# EAGLE design VentilationsEvaluationDevBoard_v2.1.3_USB_C (EAGLE 9.6.2)
TEST: 1234

## Sheet 1 of 3
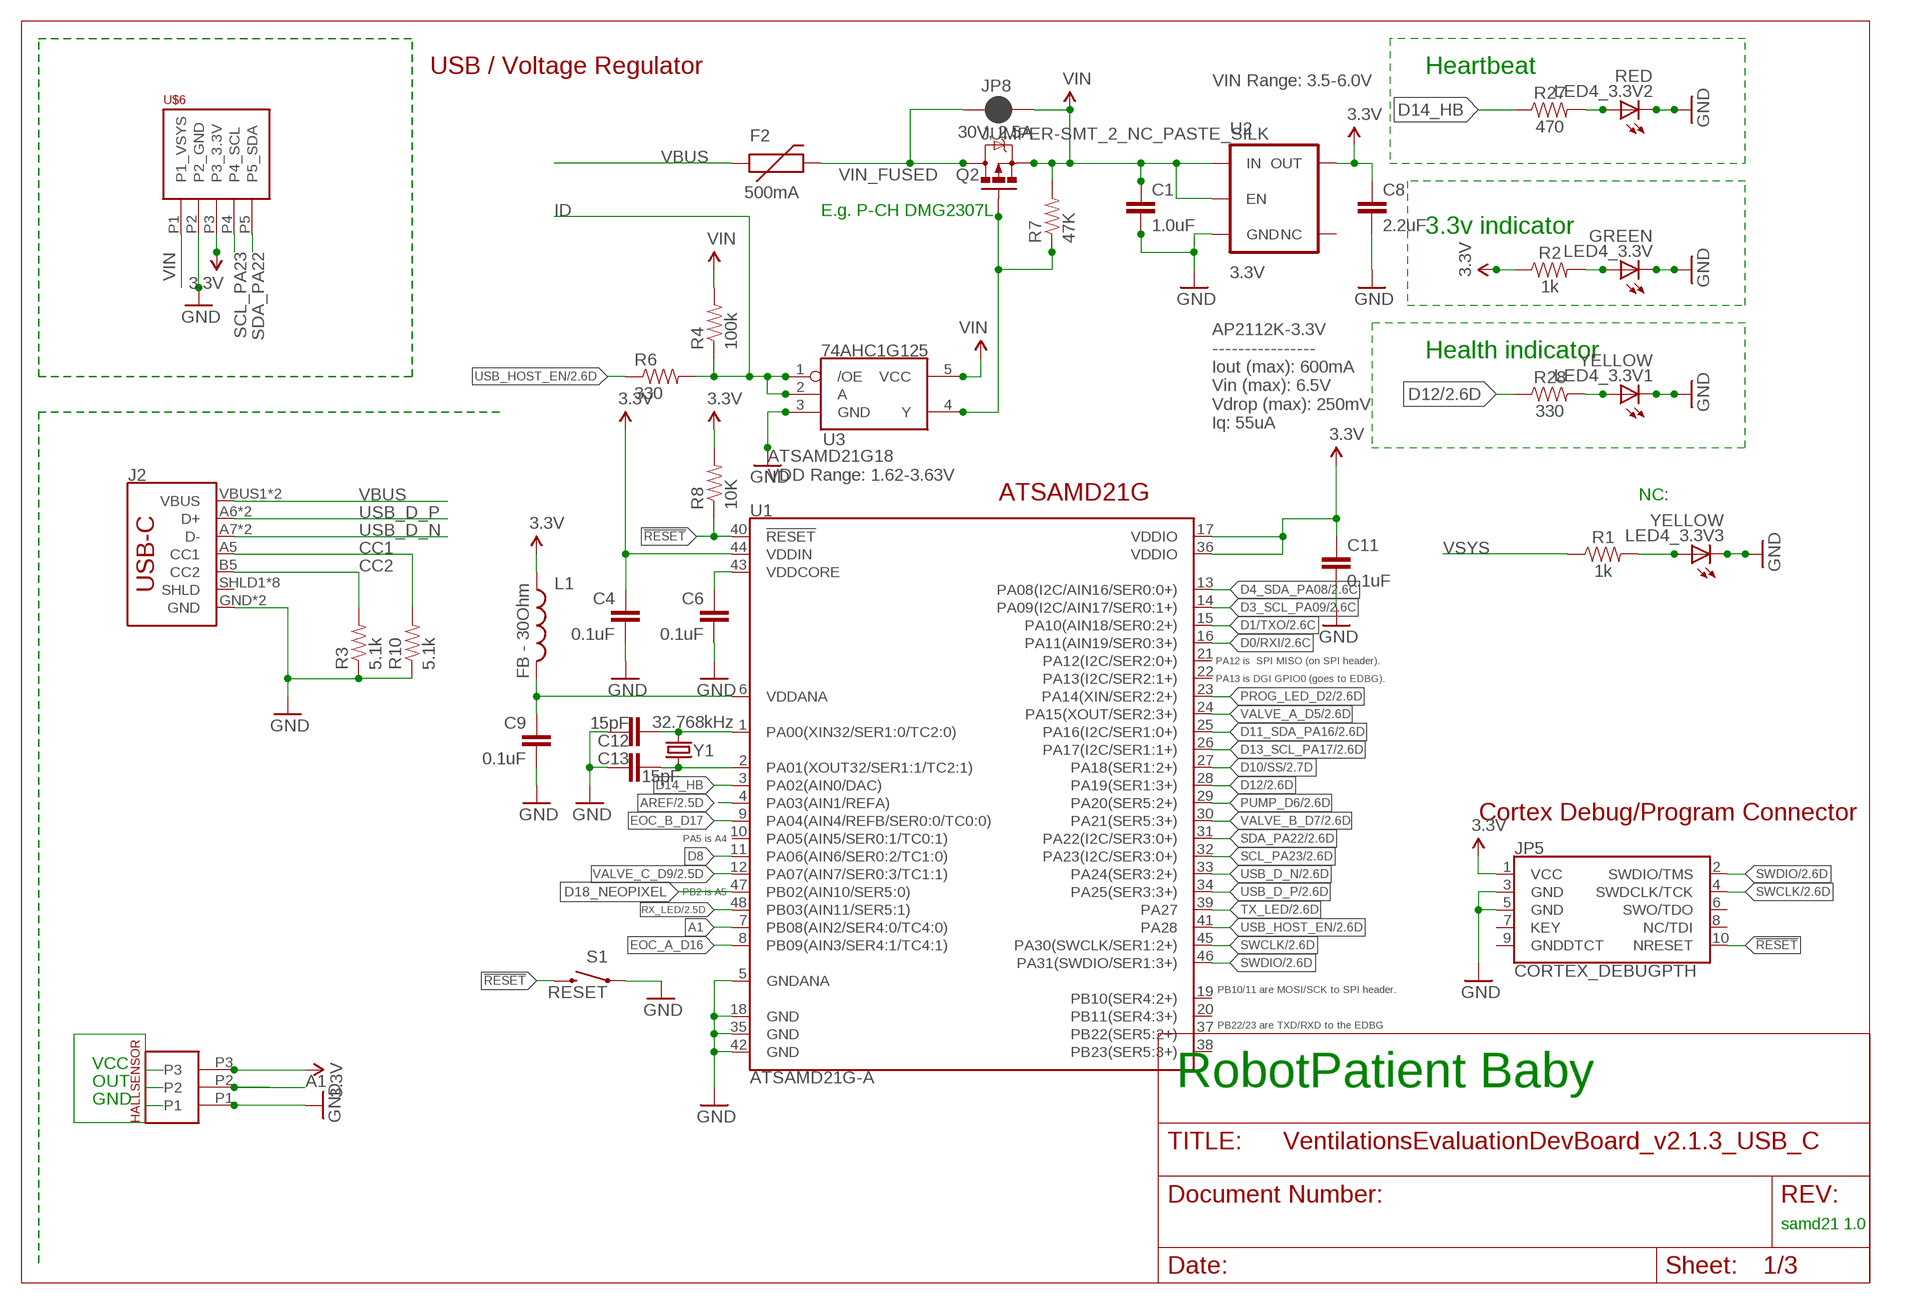
[diagram p0: schematic, sheet 1]

### Parts
C1  1.0uF  1.0UF-25V-+80/-20(0805)  [0805]
C4  0.1uF  0.1UF-16V(+-10%)(0402)  [0402-CAP]
C6  0.1uF  0.1UF-16V(+-10%)(0402)  [0402-CAP]
C8  2.2uF  2.2UF-10V-20%(0603)  [0603-CAP]
C9  0.1uF  0.1UF-16V(+-10%)(0402)  [0402-CAP]
C11  0.1uF  0.1UF-16V(+-10%)(0402)  [0402-CAP]
C12  15pF  15PF-50V(+-5%)(0402)  [0402-CAP]
C13  15pF  15PF-50V(+-5%)(0402)  [0402-CAP]
F2  500mA  PTCSMD  [PTC-1206]
HALLSENSOR  PHOENIX_PTSM_M3_TH_UP  [PTSM_M3_THR_UP]
J2  USB_C16PIN  [USB-C-16P]
JP5  CORTEX_DEBUGPTH  [2X5-PTH-1.27MM]
JP8  JUMPER-SMT_2_NC_PASTE_SILK  [SMT-JUMPER_2_NC_PASTE_SILK]
L1  FB - 30Ohm  INDUCTOR0603  [0603]
LED4_3.3V  GREEN  LED0603  [LED-0603]
LED4_3.3V1  YELLOW  LED0603  [LED-0603]
LED4_3.3V2  RED  LED0603  [LED-0603]
LED4_3.3V3  YELLOW  LED0603  [LED-0603]
Q2  30V, 2.5A  MOSFET-PCHANNELDMG2307L  [SOT23-3]
R1  1k  1KOHM-0603-1/10W-1%  [0603]
R2  1k  1KOHM-0603-1/10W-1%  [0603]
R3  5.1k  10KOHM-1/10W-1%(0603)0603  [0603-RES]
R4  100k  100KOHM-1/10W-1%(0603)  [0603-RES]
R6  330  330OHM1/10W1%(0603)  [0603-RES]
R7  47K  47KOHM1/10W1%(0603)  [0603-RES]
R8  10K  10KOHM-1/10W-1%(0603)0603  [0603-RES]
R10  5.1k  10KOHM-1/10W-1%(0603)0603  [0603-RES]
R27  470  470OHM-0603-1/10W-1%  [0603]
R28  330  330OHM-0603-1/10W-1%  [0603]
S1  RESET  SWITCH-MOMENTARY-2SMD-4.6X2.8MM  [TACTILE_SWITCH_SMD_4.6X2.8MM]
U1  ATSAMD21G-A  [TQFP-48]
U2  3.3V  V_REG_AP2112K-3.3V  [SOT23-5]
U3  74AHC1G125  [SOT23-5]
U$6  PHOENIX_PTSM_M5_TH_UP  [PTSM_M5_THR_UP]
Y1  32.768kHz  CRYSTAL3.2X1.5MM  [CRYSTAL-SMD-3.2X1.5MM]

### Nets
3.3V [power]: C4.1 C8.1 C11.1 HALLSENSOR.P3 JP5.1(VCC) L1.1 R2.1 R8.2 U1.17(VDDIO) U1.36(VDDIO) U1.44(VDDIN) U2.5(OUT) U$6.P3(P3_3.3V) ; also sheet 2,3
!RESET: JP5.10(NRESET) R8.1 S1.3 S1.4 U1.40(!RESET!)
A1: HALLSENSOR.P2 U1.7(PB08(AIN2/SER4:0/TC4:0))
AREF: U1.4(PA03(AIN1/REFA)) ; also sheet 2
CC1: J2.A5(CC1) R10.2
CC2: J2.B5(CC2) R3.2
D0/RXI: U1.16(PA11(AIN19/SER0:3+)) ; also sheet 2
D1/TXO: U1.15(PA10(AIN18/SER0:2+)) ; also sheet 2
D3_SCL_PA09: U1.14(PA09(I2C/AIN17/SER0:1+)) ; also sheet 2,3
D4_SDA_PA08: U1.13(PA08(I2C/AIN16/SER0:0+)) ; also sheet 2,3
D8: U1.11(PA06(AIN6/SER0:2/TC1:0))
D10/SS: U1.27(PA18(SER1:2+)) ; also sheet 2
D11_SDA_PA16: U1.25(PA16(I2C/SER1:0+)) ; also sheet 2,3
D12: R28.1 U1.28(PA19(SER1:3+)) ; also sheet 2
D13_SCL_PA17: U1.26(PA17(I2C/SER1:1+)) ; also sheet 2,3
D14_HB: R27.1 U1.3(PA02(AIN0/DAC))
D18_NEOPIXEL: U1.47(PB02(AIN10/SER5:0)) ; also sheet 2
EOC_A_D16: U1.8(PB09(AIN3/SER4:1/TC4:1)) ; also sheet 3
EOC_B_D17: U1.9(PA04(AIN4/REFB/SER0:0/TC0:0)) ; also sheet 3
GND [ground]: C1.2 C4.2 C6.2 C8.2 C9.2 C11.2 C12.1 C13.2 HALLSENSOR.P1 J2.GND J2.GND2(GND) JP5.3(GND) JP5.5(GND) LED4_3.3V1.C LED4_3.3V2.C LED4_3.3V3.C LED4_3.3V.C R3.1 R10.1 S1.1 S1.2 U1.5(GNDANA) U1.18(GND) U1.35(GND) U1.42(GND) U2.2(GND) U3.3(GND) U$6.P2(P2_GND) ; also sheet 2,3
ID: R4.1 R6.2 U3.1(/OE) U3.2(A)
N$1: LED4_3.3V2.A R27.2
N$2: LED4_3.3V1.A R28.2
N$3: LED4_3.3V3.A R1.2
N$8: C12.2 U1.1(PA00(XIN32/SER1:0/TC2:0)) Y1.P$2
N$12: Q2.1(G) R7.1 U3.4(Y)
N$13: C13.1 U1.2(PA01(XOUT32/SER1:1/TC2:1)) Y1.P$1
N$33: LED4_3.3V.A R2.2
PROG_LED_D2: U1.23(PA14(XIN/SER2:2+)) ; also sheet 2
PUMP_D6: U1.29(PA20(SER5:2+)) ; also sheet 2,3
RX_LED: U1.48(PB03(AIN11/SER5:1)) ; also sheet 2
SCL_PA23: U1.32(PA23(I2C/SER3:0+)) U$6.P4(P4_SCL) ; also sheet 2
SDA_PA22: U1.31(PA22(I2C/SER3:0+)) U$6.P5(P5_SDA) ; also sheet 2
SWCLK: JP5.4(SWDCLK/TCK) U1.45(PA30(SWCLK/SER1:2+)) ; also sheet 2
SWDIO: JP5.2(SWDIO/TMS) U1.46(PA31(SWDIO/SER1:3+)) ; also sheet 2
TX_LED: U1.39(PA27) ; also sheet 2
USB_D_N [diff_pair]: J2.A7(D-) J2.B7(D-) U1.33(PA24(SER3:2+)) ; also sheet 2
USB_D_P [diff_pair]: J2.A6(D+) J2.B6(D+) U1.34(PA25(SER3:3+)) ; also sheet 2
USB_HOST_EN: R6.1 U1.41(PA28) ; also sheet 2
VALVE_A_D5: U1.24(PA15(XOUT/SER2:3+)) ; also sheet 2,3
VALVE_B_D7: U1.30(PA21(SER5:3+)) ; also sheet 2,3
VALVE_C_D9: U1.12(PA07(AIN7/SER0:3/TC1:1)) ; also sheet 2,3
VBUS [power]: F2.1 J2.VBUS1(VBUS) J2.VBUS2(VBUS)
VDDANA [power]: C9.1 L1.2 U1.6(VDDANA)
VDDCORE [power]: C6.1 U1.43(VDDCORE)
VIN [power]: C1.1 JP8.2 Q2.2(S) R4.2 R7.2 U2.1(IN) U2.3(EN) U3.5(VCC) U$6.P1(P1_VSYS) ; also sheet 2
VIN_FUSED [power]: F2.2 JP8.1 Q2.3(D) ; also sheet 2
VSYS [power]: R1.1 ; also sheet 2
Unconnected: J2.SHLD1(SHLD) J2.SHLD2(SHLD) J2.SHLD3(SHLD) J2.SHLD4(SHLD) J2.SHLD5(SHLD) J2.SHLD6(SHLD) J2.SHLD7(SHLD) J2.SHLD8(SHLD) JP5.6(SWO/TDO) JP5.7(KEY) JP5.8(NC/TDI) JP5.9(GNDDTCT) U1.10(PA05(AIN5/SER0:1/TC0:1)) U1.19(PB10(SER4:2+)) U1.20(PB11(SER4:3+)) U1.21(PA12(I2C/SER2:0+)) U1.22(PA13(I2C/SER2:1+)) U1.37(PB22(SER5:2+)) U1.38(PB23(SER5:3+)) U2.4(NC)

### Notes on the sheet
- USB / Voltage Regulator
- VIN Range: 3.5-6.0V | Heartbeat
- E.g. P-CH DMG2307L
- 3.3v indicator
- AP2112K-3.3V
  ----------------
  Iout (max): 600mA 
  Vin (max): 6.5V
  Vdrop (max): 250mV
  Iq: 55uA
- Health indicator
- ATSAMD21G18
  VDD Range: 1.62-3.63V
- ATSAMD21G
- NC:
- PA12 is  SPI MISO (on SPI header).
- PA13 is DGI GPIO0 (goes to EDBG).
- Cortex Debug/Program Connector
- PA5 is A4
- PB2 is A5
- PB10/11 are MOSI/SCK to SPI header.
- PB22/23 are TXD/RXD to the EDBG
- VCC
- OUT | RobotPatient Baby
- GND
- samd21 1.0

## Sheet 2 of 3
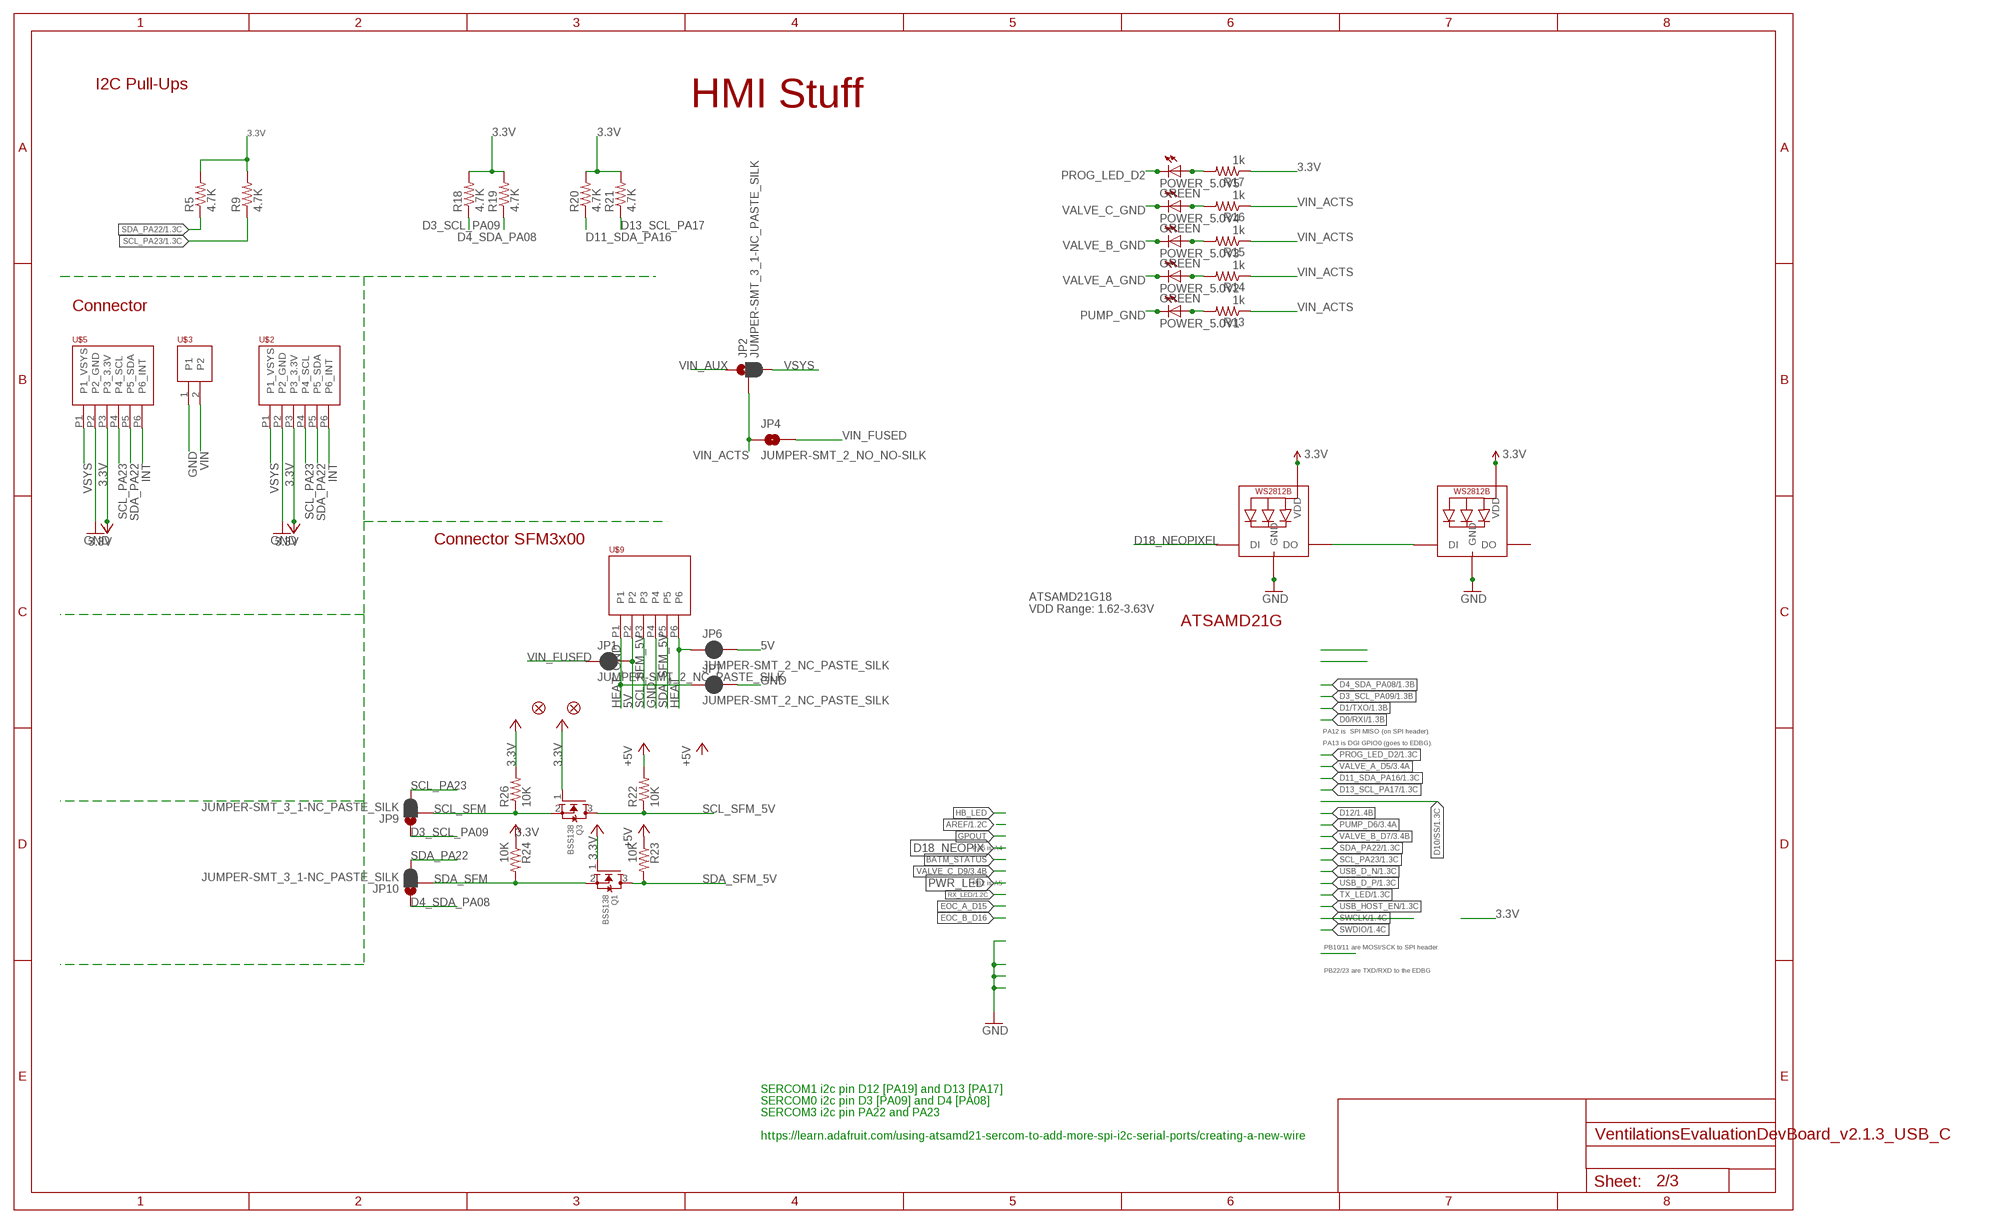
[diagram p1: schematic, sheet 2]

### Parts
FD1  FIDUCIAL1X2  [FIDUCIAL-1X2]
FD2  FIDUCIAL1X2  [FIDUCIAL-1X2]
JP1  JUMPER-SMT_2_NC_PASTE_SILK  [SMT-JUMPER_2_NC_PASTE_SILK]
JP2  JUMPER-SMT_3_1-NC_PASTE_SILK  [SMT-JUMPER_3_1-NC_PASTE_SILK]
JP4  JUMPER-SMT_2_NO_NO-SILK  [SMT-JUMPER_2_NO_NO-SILK]
JP6  JUMPER-SMT_2_NC_PASTE_SILK  [SMT-JUMPER_2_NC_PASTE_SILK]
JP7  JUMPER-SMT_2_NC_PASTE_SILK  [SMT-JUMPER_2_NC_PASTE_SILK]
JP9  JUMPER-SMT_3_1-NC_PASTE_SILK  [SMT-JUMPER_3_1-NC_PASTE_SILK]
JP10  JUMPER-SMT_3_1-NC_PASTE_SILK  [SMT-JUMPER_3_1-NC_PASTE_SILK]
LED1  WS2812B3535  [LED3535]
LED2  WS2812B3535  [LED3535]
POWER_5.0V1  GREEN  LED0603  [LED-0603]
POWER_5.0V2  GREEN  LED0603  [LED-0603]
POWER_5.0V3  GREEN  LED0603  [LED-0603]
POWER_5.0V4  GREEN  LED0603  [LED-0603]
POWER_5.0V5  GREEN  LED0603  [LED-0603]
Q1  BSS138  MOSFET-NREFLOW  [SOT23]
Q3  BSS138  MOSFET-NREFLOW  [SOT23]
R5  4.7K  4.7KOHM-1/10W-1%(0603)  [0603-RES@1]
R9  4.7K  4.7KOHM-1/10W-1%(0603)  [0603-RES@1]
R13  1k  10KOHM-1/10W-1%(0603)0603  [0603-RES]
R14  1k  10KOHM-1/10W-1%(0603)0603  [0603-RES]
R15  1k  10KOHM-1/10W-1%(0603)0603  [0603-RES]
R16  1k  10KOHM-1/10W-1%(0603)0603  [0603-RES]
R17  1k  10KOHM-1/10W-1%(0603)0603  [0603-RES]
R18  4.7K  4.7KOHM-1/10W-1%(0603)  [0603-RES@1]
R19  4.7K  4.7KOHM-1/10W-1%(0603)  [0603-RES@1]
R20  4.7K  4.7KOHM-1/10W-1%(0603)  [0603-RES@1]
R21  4.7K  4.7KOHM-1/10W-1%(0603)  [0603-RES@1]
R22  10K  R-US_R0805  [R0805]
R23  10K  R-US_R0805  [R0805]
R24  10K  R-US_R0805  [R0805]
R26  10K  R-US_R0805  [R0805]
U$2  PHOENIX_PTSM_M6_TH_I2CPPANGLE  [PTSM_M6_THRHOLE]
U$3  PHOENIX_PTSM_M2_TH  [PTSM_M2_THRHOLE]
U$5  PHOENIX_PTSM_M6_TH_I2CPPANGLE  [PTSM_M6_THRHOLE]
U$9  PHOENIX_PTSM_M6_TH_UP_NEUTRAL  [PTSM_M6_TH_UP_NEUTRAL]

### Nets
3.3V [power]: LED1.2(VDD) LED2.2(VDD) Q1.1(G) Q3.1(G) R5.2 R9.2 R17.1 R18.2 R19.2 R20.2 R21.2 R24.1 R26.2 U$2.P3(P3_3.3V) U$5.P3(P3_3.3V) ; supply symbol labelled +3V3 ; also sheet 1,3
5V [power]: JP1.2 JP6.2 R22.2 R23.1 U$9.P2 ; supply symbol labelled +5V
D3_SCL_PA09: JP9.1 R18.1 ; also sheet 1,3
D4_SDA_PA08: JP10.1 R19.1 ; also sheet 1,3
D11_SDA_PA16: R20.1 ; also sheet 1,3
D13_SCL_PA17: R21.1 ; also sheet 1,3
D18_NEOPIXEL: LED1.1(DI) ; also sheet 1
GND [ground]: JP7.2 LED1.4(GND) LED2.4(GND) U$2.P2(P2_GND) U$3.1 U$5.P2(P2_GND) U$9.P4 ; also sheet 1,3
HEAT [power]: JP6.1 U$9.P6
HEAT_GND [ground]: JP7.1 U$9.P1
INT: U$2.P6(P6_INT) U$5.P6(P6_INT)
N$24: POWER_5.0V1.A R13.2
N$25: POWER_5.0V2.A R14.2
N$27: POWER_5.0V3.A R15.2
N$28: POWER_5.0V4.A R16.2
N$29: POWER_5.0V5.A R17.2
NEOPIXEL_2: LED1.3(DO) LED2.1(DI)
PROG_LED_D2: POWER_5.0V5.C ; also sheet 1
PUMP_GND [ground]: POWER_5.0V1.C ; also sheet 3
SCL_PA23: JP9.3 R9.1 U$2.P4(P4_SCL) U$5.P4(P4_SCL) ; also sheet 1
SCL_SFM: JP9.2 Q3.2(S) R26.1
SCL_SFM_5V: Q3.3(D) R22.1 U$9.P3
SDA_PA22: JP10.3 R5.1 U$2.P5(P5_SDA) U$5.P5(P5_SDA) ; also sheet 1
SDA_SFM: JP10.2 Q1.2(S) R24.2
SDA_SFM_5V: Q1.3(D) R23.2 U$9.P5
VALVE_A_GND [ground]: POWER_5.0V2.C ; also sheet 3
VALVE_B_GND [ground]: POWER_5.0V3.C ; also sheet 3
VALVE_C_GND [ground]: POWER_5.0V4.C ; also sheet 3
VIN [power]: U$3.2 ; also sheet 1
VIN_ACTS [power]: JP2.2 JP4.1 R13.1 R14.1 R15.1 R16.1 ; also sheet 3
VIN_AUX: JP2.1
VIN_FUSED [power]: JP1.1 JP4.2 ; also sheet 1
VSYS [power]: JP2.3 U$2.P1(P1_VSYS) U$5.P1(P1_VSYS) ; also sheet 1
Unconnected: LED2.3(DO)

### Notes on the sheet
- I2C Pull-Ups | HMI Stuff
- Connector
- Connector SFM3x00
- ATSAMD21G18
  VDD Range: 1.62-3.63V
- ATSAMD21G
- PA12 is  SPI MISO (on SPI header).
- PA13 is DGI GPIO0 (goes to EDBG).
- PA5 is A4
- PB2 is A5
- PB10/11 are MOSI/SCK to SPI header.
- PB22/23 are TXD/RXD to the EDBG
- SERCOM1 i2c pin D12 [PA19] and D13 [PA17]
- SERCOM0 i2c pin D3 [PA09] and D4 [PA08]
- SERCOM3 i2c pin PA22 and PA23
- https://learn.adafruit.com/using-atsamd21-sercom-to-add-more-spi-i2c-serial-ports/creating-a-new-wire

## Sheet 3 of 3
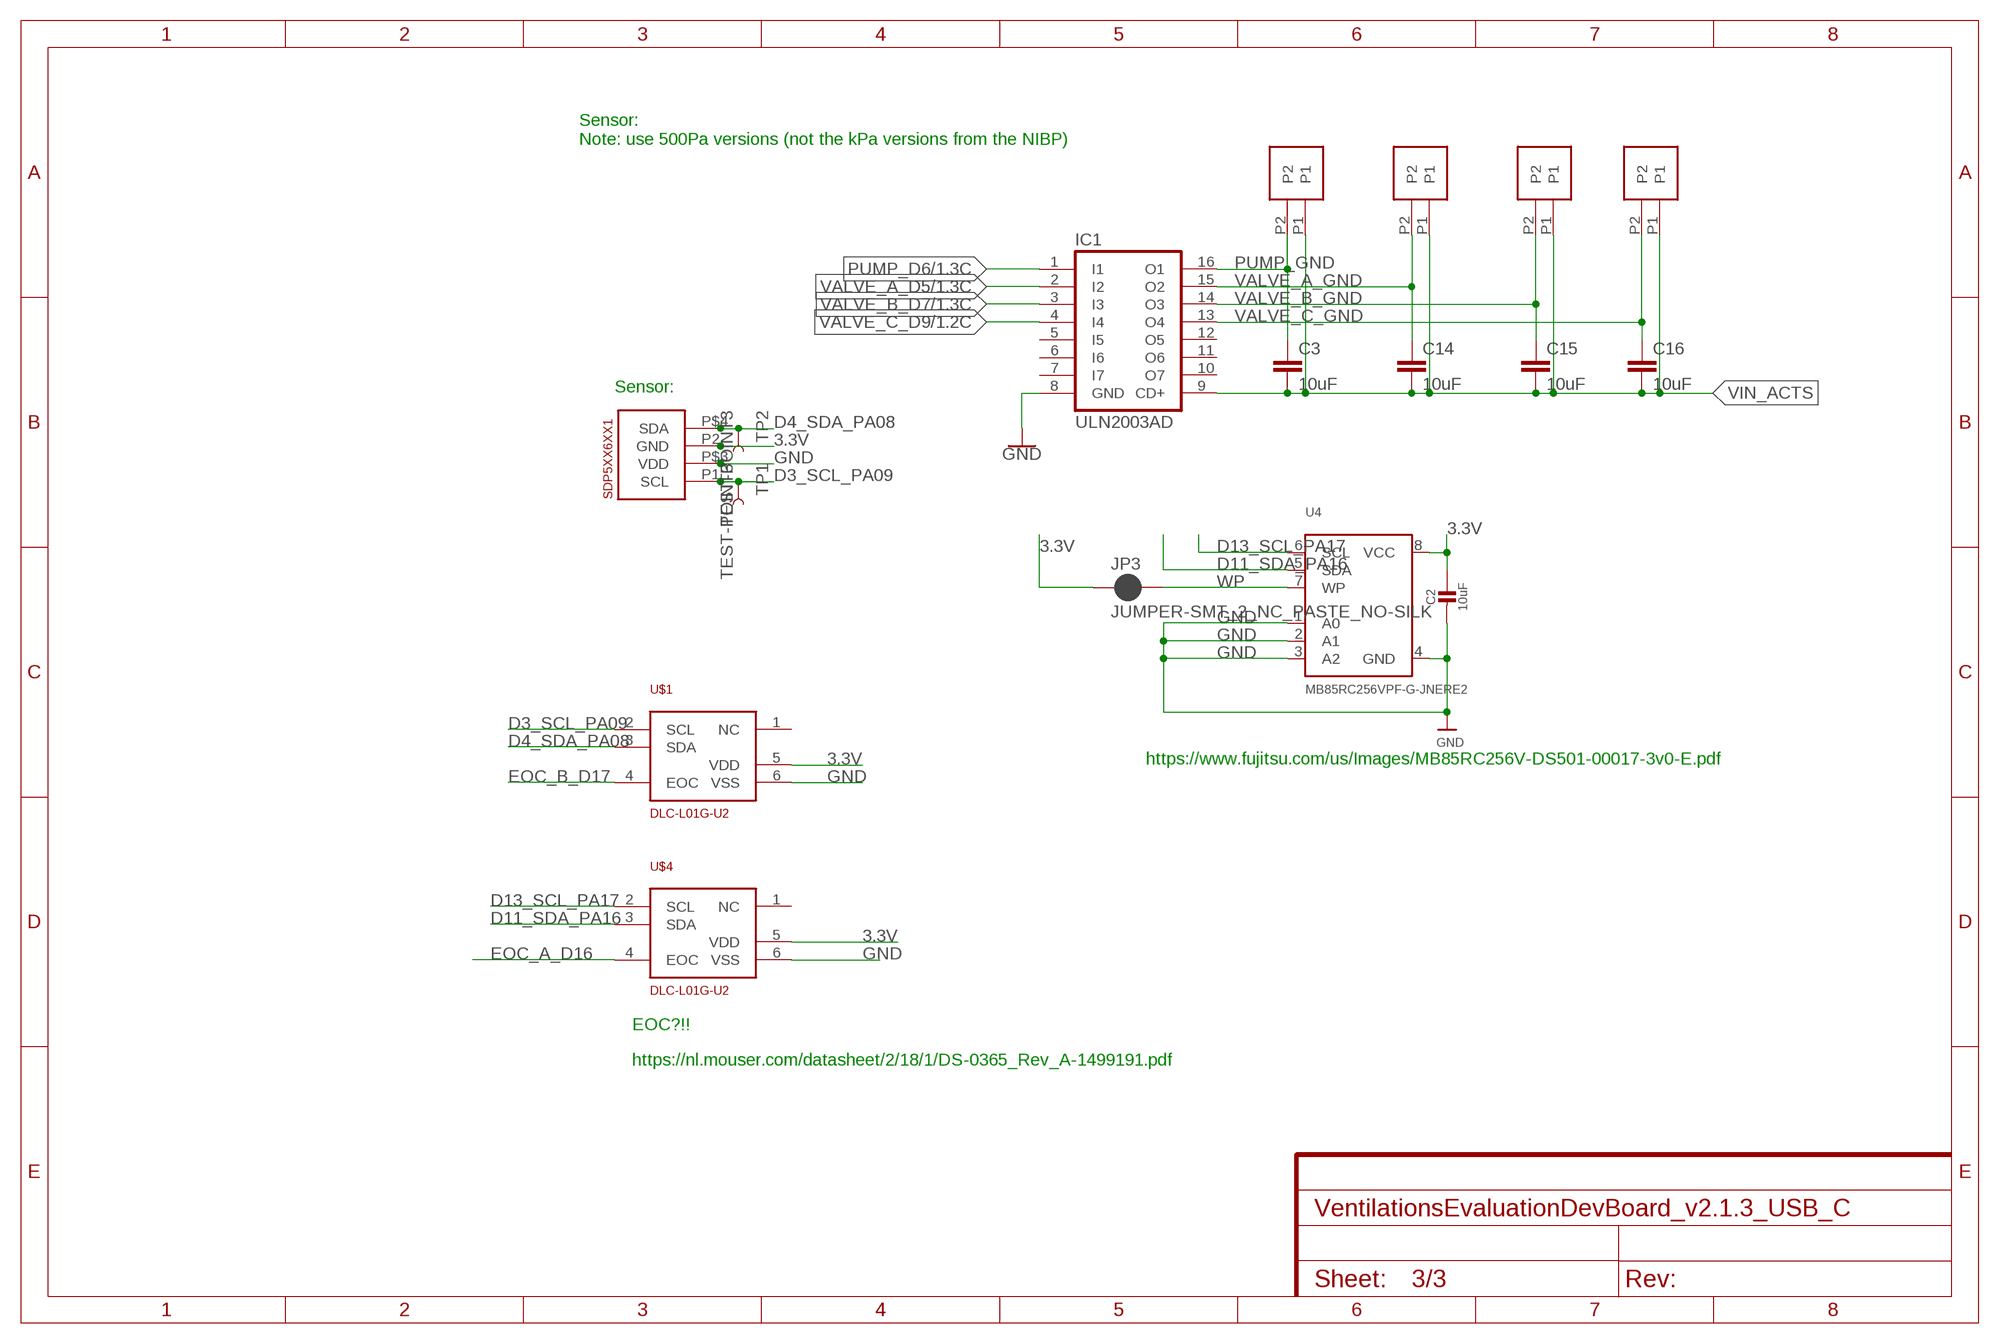
[diagram p2: schematic, sheet 3]

### Parts
C2  10uF  CAP_CERAMIC_0805MP  [_0805MP]
C3  10uF  10UF-0805-10V-10%  [0805]
C14  10uF  10UF-0805-10V-10%  [0805]
C15  10uF  10UF-0805-10V-10%  [0805]
C16  10uF  10UF-0805-10V-10%  [0805]
IC1  ULN2003AD  [SO16]
JP3  JUMPER-SMT_2_NC_PASTE_NO-SILK  [SMT-JUMPER_2_NC_PASTE_NO-SILK]
PUMP  PHOENIX_PTSM_M2_SMD  [PTSM_M2_SMD]
SDP5XX6XX1  SDP5XX_6XX  [SDP5XX_6XX]
TP1  TEST-POINT3  [PAD.03X.03]
TP2  TEST-POINT3  [PAD.03X.03]
U4  MB85RC256VPF-G-JNERE2  FRAM_SOIC8_I2C  [SOIC8_208MIL]
U$1  DLC-L01G-U2  [DLC-L01G-U2]
U$4  DLC-L01G-U2  [DLC-L01G-U2]
VALVE_A  PHOENIX_PTSM_M2_SMD  [PTSM_M2_SMD]
VALVE_B  PHOENIX_PTSM_M2_SMD  [PTSM_M2_SMD]
VALVE_C  PHOENIX_PTSM_M2_SMD  [PTSM_M2_SMD]

### Nets
3.3V [power]: C2.1 JP3.1 SDP5XX6XX1.P2(GND) U4.8(VCC) U$1.5(VDD) U$4.5(VDD) ; also sheet 1,2
D3_SCL_PA09: SDP5XX6XX1.P1(SCL) TP1.P$1 U$1.2(SCL) ; also sheet 1,2
D4_SDA_PA08: SDP5XX6XX1.P$4(SDA) TP2.P$1 U$1.3(SDA) ; also sheet 1,2
D11_SDA_PA16: U4.5(SDA) U$4.3(SDA) ; also sheet 1,2
D13_SCL_PA17: U4.6(SCL) U$4.2(SCL) ; also sheet 1,2
EOC_A_D16: U$4.4(EOC) ; also sheet 1
EOC_B_D17: U$1.4(EOC) ; also sheet 1
GND [ground]: C2.2 IC1.8(GND) SDP5XX6XX1.P$3(VDD) U4.1(A0) U4.2(A1) U4.3(A2) U4.4(GND) U$1.6(VSS) U$4.6(VSS) ; also sheet 1,2
PUMP_D6: IC1.1(I1) ; also sheet 1,2
PUMP_GND [ground]: C3.1 IC1.16(O1) PUMP.P2 ; also sheet 2
VALVE_A_D5: IC1.2(I2) ; also sheet 1,2
VALVE_A_GND [ground]: C14.1 IC1.15(O2) VALVE_A.P2 ; also sheet 2
VALVE_B_D7: IC1.3(I3) ; also sheet 1,2
VALVE_B_GND [ground]: C15.1 IC1.14(O3) VALVE_B.P2 ; also sheet 2
VALVE_C_D9: IC1.4(I4) ; also sheet 1,2
VALVE_C_GND [ground]: C16.1 IC1.13(O4) VALVE_C.P2 ; also sheet 2
VIN_ACTS [power]: C3.2 C14.2 C15.2 C16.2 IC1.9(CD+) PUMP.P1 VALVE_A.P1 VALVE_B.P1 VALVE_C.P1 ; also sheet 2
WP: JP3.2 U4.7(WP)
Unconnected: IC1.5(I5) IC1.6(I6) IC1.7(I7) IC1.10(O7) IC1.11(O6) IC1.12(O5) U$1.1(NC) U$4.1(NC)

### Notes on the sheet
- Sensor:
  Note: use 500Pa versions (not the kPa versions from the NIBP)
- Sensor:
- https://www.fujitsu.com/us/Images/MB85RC256V-DS501-00017-3v0-E.pdf
- EOC?!!
- https://nl.mouser.com/datasheet/2/18/1/DS-0365_Rev_A-1499191.pdf

## Library data of the parts
C1 = SparkFun-Capacitors:1.0UF-25V-+80/-20(0805): CAP-11625; PROD_ID: CAP-11625
C2 = microbuilder:CAP_CERAMIC: Ceramic Capacitors For new designs, use the packages preceded by an '_' character since they are more reliable: The following footprints should be used on most boards: _0402 - Standard footprint for regular board layouts _0603 - Standard footprint for regular board layouts _0805 - Standard footprint for regular board layouts _1206 - Standard footprint for regular board layouts For extremely tight-pitch boards where space is at a premium, the following 'micro-pitch' footprints can be used (smaller pads, no silkscreen outline, etc.): _0402MP - Micro-pitch footprint for very dense/compact boards _0603MP - Micro-pitch footprint for very dense/compact boards _0805MP - Micro-pitch footprint for very dense/compact boards _1206MP - Micro-pitch footprint for very dense/compact boards
C3 C14-C16 = SparkFun-Capacitors:10UF: 10.0µF ceramic capacitors A capacitor is a passive two-terminal electrical component used to store electrical energy temporarily in an electric field.; PROD_ID: CAP-11330
C4 C6 C9 C11 = SparkFun-Capacitors:0.1UF-16V(+-10%)(0402); PROD_ID: CAP-12416
C8 = SparkFun-Capacitors:2.2UF-10V-20%(0603): CAP-07888; PROD_ID: CAP-07888
C12 C13 = samd21-temp:15PF-50V(+-5%)(0402); PROD_ID: CAP-13063
F2 = SparkFun-PowerIC:PTC: Resettable Fuse PTC Resettable Fuse. Spark Fun Electronics SKU : COM-08357; PROD_ID: RES-11150
FD1 FD2 = SparkFun-Aesthetics:FIDUCIAL: Fiducial Alignment Points Point-of-reference for pick-and-place machines and other optical instruments.
HALLSENSOR = jk_customs:PHOENIX_PTSM_M3_TH_UP
IC1 = uln-udn:ULN2003A: DRIVER ARRAY
J2 = SparkFun-Connectors:USB_C: USB Type C 16Pin Connector Super Speed pins not available on the 16-pin purely SMD connector so this part is best for USB 2.0 implementations. D1 and D2 are tied together enabling D+/- no matter which way the cable is plugged into the connector. The two channel configuration pins (CC1/2) are exposed. These are normally connected to ground via 5.1k resistors but can be reconfigured for high current/high power applications.; PROD_ID: CONN-14122
JP1 JP3 JP6-JP8 = SparkFun-Jumpers:JUMPER-SMT_2_NC_PASTE: Normally closed solder jumper This jumper has an aperture in the stencil to allow solder paste to bridge the split in the wire so it's normally closed (NC). Wick off the solder to open the connection. Reapply solder to reclose the connection.
JP2 JP9 JP10 = SparkFun-Jumpers:JUMPER-SMT_3_1-NC_PASTE: Normally closed solder jumper (1 of 2 connections) This jumper has an aperture in the stencil to allow solder paste to bridge one of the two connections. One connection is normally closed (NC), while the other is normally open (NO). Wick off the solder to open the connection. Reapply solder to reclose the connection. Apply solder to the other side instead to change the current path.
JP4 = SparkFun-Jumpers:JUMPER-SMT_2_NO: Normally open jumper This jumper has two pads in close proximity to each other. Apply solder to close the connection. Round pads are easier to solder for beginners, but are a lot larger. SparkFun Product that uses the round pads: SparkFun EL Sequencer <https://www.sparkfun.com/products/12781>
JP5 = samd21-temp:CORTEX_DEBUG: Cortex Debug Connector Datasheet <http://infocenter.arm.com/help/topic/com.arm.doc.faqs/attached/13634/cortex_debug_connectors.pdf>
L1 = SparkFun-Passives:INDUCTOR: Inductors Basic Inductor/Choke - 0603 and 1206. Footprints are not proven and vary greatly between part numbers. SRN6045- 33uH, 20% 1.4A SDR0403-560KL - 56uH, 10%, 500mA RMS/740mA peak; PROD_ID: RES-07859
LED1 LED2 = microbuilder:WS2812B
LED4_3.3V LED4_3.3V1-LED4_3.3V3 POWER_5.0V1-POWER_5.0V5 = SparkFun:LED: LEDs Standard schematic elements and footprints for 5mm, 3mm, 1206, and 0603 sized LEDs. 5mm - Spark Fun Electronics SKU : COM-00529 (and others)
PUMP VALVE_A VALVE_B VALVE_C = jk_customs:PHOENIX_PTSM_M2_SMD
Q1 Q3 = adafruit:MOSFET-N: N-Channel Mosfet 2N7002E - 60V 260mA SOT23 [Digikey: 2N7002ET1GOSTR-ND] - REEL BSH103 - 30V 850mA SOT23 [Digikey: 568-5013-1-ND]
Q2 = SparkFun-DiscreteSemi:MOSFET-PCHANNEL: Generic PMOSFET IRLML2244 - TRANS-11153 (SOT-23 -20V -4.3A) (1.Gate 2.Source 3.Drain) FQP27P06 - COM-10349 <http://www.sparkfun.com/products/10349> (TO-220 -60V -27A) (1.Gate 2.Source 3.Drain); PROD_ID: TRANS-11308
R1 R2 = SparkFun-Resistors:1KOHM: 1kΩ resistor A resistor is a passive two-terminal electrical component that implements electrical resistance as a circuit element. Resistors act to reduce current flow, and, at the same time, act to lower voltage levels within circuits. - Wikipedia; PROD_ID: RES-07856
R3 R10 R13-R17 = SparkFun-Resistors:10KOHM-1/10W-1%(0603): RES-00824; PROD_ID: RES-00824; VALUE: 10K
R4 = SparkFun-Resistors:100KOHM-1/10W-1%(0603): RES-07828; PROD_ID: RES-07828
R5 R9 R18-R21 = SparkFun-Resistors:4.7KOHM-1/10W-1%(0603): RES-07857; PROD_ID: RES-07857
R6 = SparkFun-Resistors:330OHM1/10W1%(0603): RES-00818; PROD_ID: RES-00818
R7 = SparkFun-Resistors:47KOHM1/10W1%(0603): RES-07871; PROD_ID: RES-07871
R8 = SparkFun-Resistors:10KOHM-1/10W-1%(0603): RES-00824; PROD_ID: RES-00824
R22-R24 R26 = adafruit:R-US_: RESISTOR, American symbol
R27 = SparkFun-Resistors:470OHM: 470Ω resistor A resistor is a passive two-terminal electrical component that implements electrical resistance as a circuit element. Resistors act to reduce current flow, and, at the same time, act to lower voltage levels within circuits. - Wikipedia; PROD_ID: RES-07869
R28 = SparkFun-Resistors:330OHM: 330Ω resistor A resistor is a passive two-terminal electrical component that implements electrical resistance as a circuit element. Resistors act to reduce current flow, and, at the same time, act to lower voltage levels within circuits. - Wikipedia; PROD_ID: RES-00818
S1 = samd21-temp:SWITCH-MOMENTARY-2: Various NO switches- pushbuttons, reed, etc; PROD_ID: SWCH-13065
SDP5XX6XX1 = jk_customs:SDP5XX_6XX: Sensirion SDP600 Series (SDP6xx/5xx) Low-cost Digital Differential Pressure Sensor
TP1 TP2 = SparkFun-Connectors:TEST-POINT: SparkFun Test Points Bare copper test points for troubleshooting or In-Circuit-Testing. These are used by our Production team for verifying production board runs using pogo-pins on test beds. SparkFun Products: SparkFun LSM9DS1 Breakout <https://www.sparkfun.com/products/13284> SparkFun PSOC <https://www.sparkfun.com/products/13714> SparkFun Load Cell Amplifier <https://www.sparkfun.com/products/13879>
U1 = samd21-temp:ATSAMD21G: Atmel SAMD21G SMART ARM-Based Microcontroller The Atmel ® | SMART ™ SAM D21 is a series of low-power microcontrollers using the 32-bit ARM ® Cortex ® -M0+ processor, and ranging from 32- to 64-pins with up to 256KB Flash and 32KB of SRAM. The SAM D21 devices operate at a maximum frequency of 48MHz and reach 2.46 CoreMark/MHz. They are designed for simple and intuitive migration with identical peripheral modules, hex compatible code, identical linear address map and pin compatible migration paths between all devices in the product series. All devices include intelligent and flexible peripherals, Atmel Event System for inter-peripheral signaling, and support for capacitive touch button, slider and wheel user interfaces.; PROD_ID: IC-13064
U2 = SparkFun-PowerIC:V_REG_AP2112: AP2112 - 600mA CMOS LDO Regulator w/ Enable The AP2112 is CMOS process low dropout linear regulator with enable function, the regulator delivers a guaranteed 600mA (min.) continuous load current. Features Output Voltage Accuracy: ±1.5% Output Current: 600mA (Min.) Foldback Short Current Protection: 50mA Enable Function to Turn ON/OFF VOUT Low Dropout Voltage (3.3V): 250mV (Typ.) @IOUT=600mA Excellent Load Regulation: 0.2%/A (Typ.) Excellent Line Regulation: 0.02%/V (Typ.) Low Quiescent Current: 55μA (Typ.) Low Standby Current: 0.01μA (Typ.) Low Output Noise: 50μVRMS PSRR: 100Hz -65dB, 1kHz -65dB OTSD Protection Stable with 1.0μF Flexible Cap: Ceramic, Tantalum and Aluminum Electrolytic Operation Temperature Range: -40°C to 85°C ESD: MM 400V, HBM 4000V; PROD_ID: VREG-12457
U3 = SparkFun-DigitalIC:74AHC1G125: Single bus buffer gate with 3-state output
U4 = microbuilder:FRAM_SOIC8_I2C: I2C FRAM - SOIC8 Package 256KBit (32Kx8) - MB85RC256VPF-G-JNERE2 - SOIC-8 200 Mil, 2.7-5.5V, -40°C-85°C
U$1 U$4 = jk_customs:DLC-L01G-U2
U$2 U$5 = jk_customs:PHOENIX_PTSM_M6_TH_I2CPP
U$3 = jk_customs:PHOENIX_PTSM_M2_TH
U$6 = jk_customs:PHOENIX_PTSM_M5_TH_UP: Datasheet <https://www.phoenixcontact.com/online/portal/us?uri=pxc-oc-itemdetail:pid=1778586&library=usen&pdfmode=direct&pdflanguage=en>
U$9 = jk_customs:PHOENIX_PTSM_M6_TH_UP_NEUTRAL
Y1 = samd21-temp:CRYSTAL: Various standard crystals. Proven footprints.; PROD_ID: XTAL-13062

## Net classes
2 ground: width 0.254 mm, drill 0.254 mm, clearance 0.152 mm
3 power: width 0.254 mm, drill 0.254 mm, clearance 0.152 mm

## Board
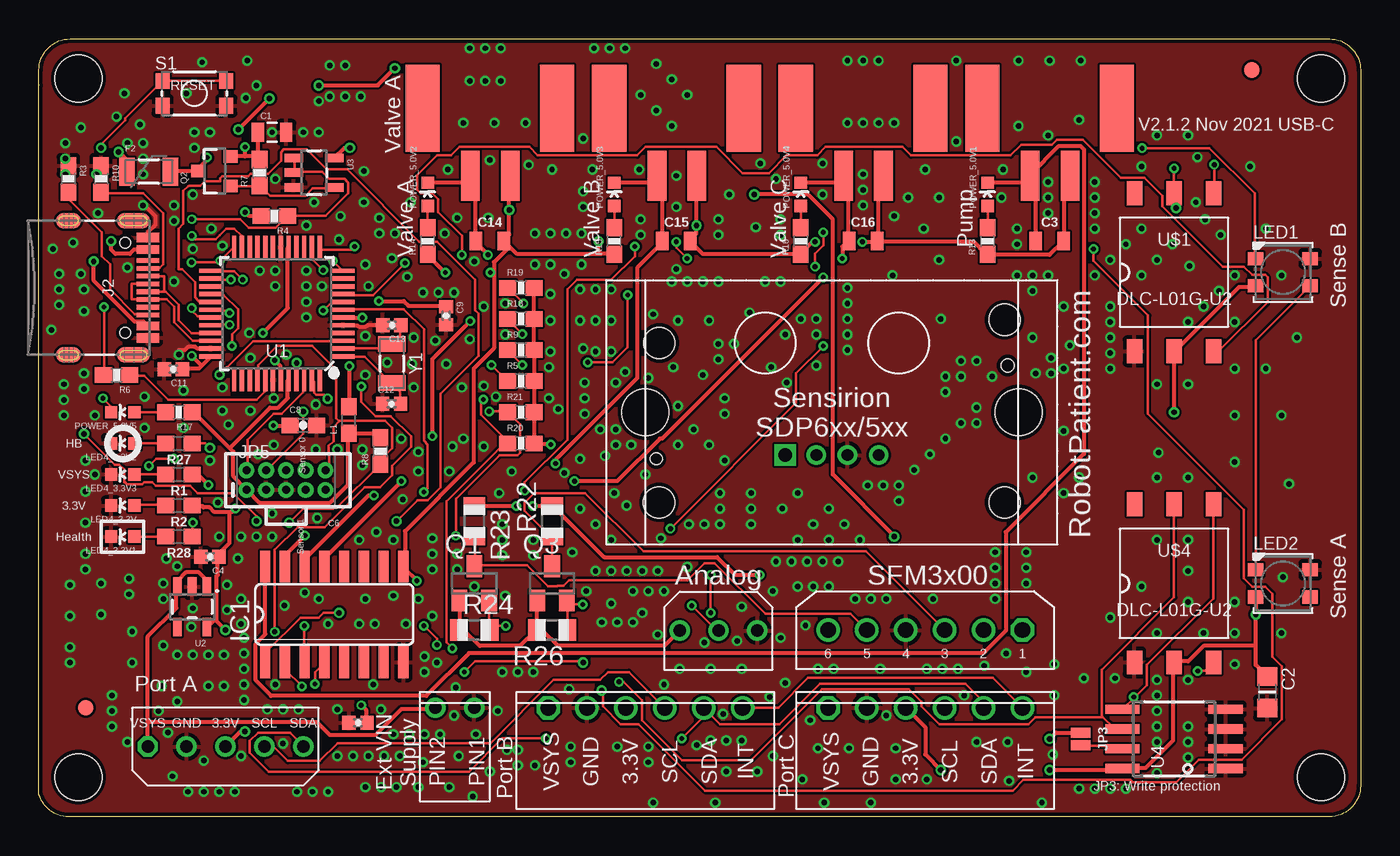
[diagram p3: board, top side]
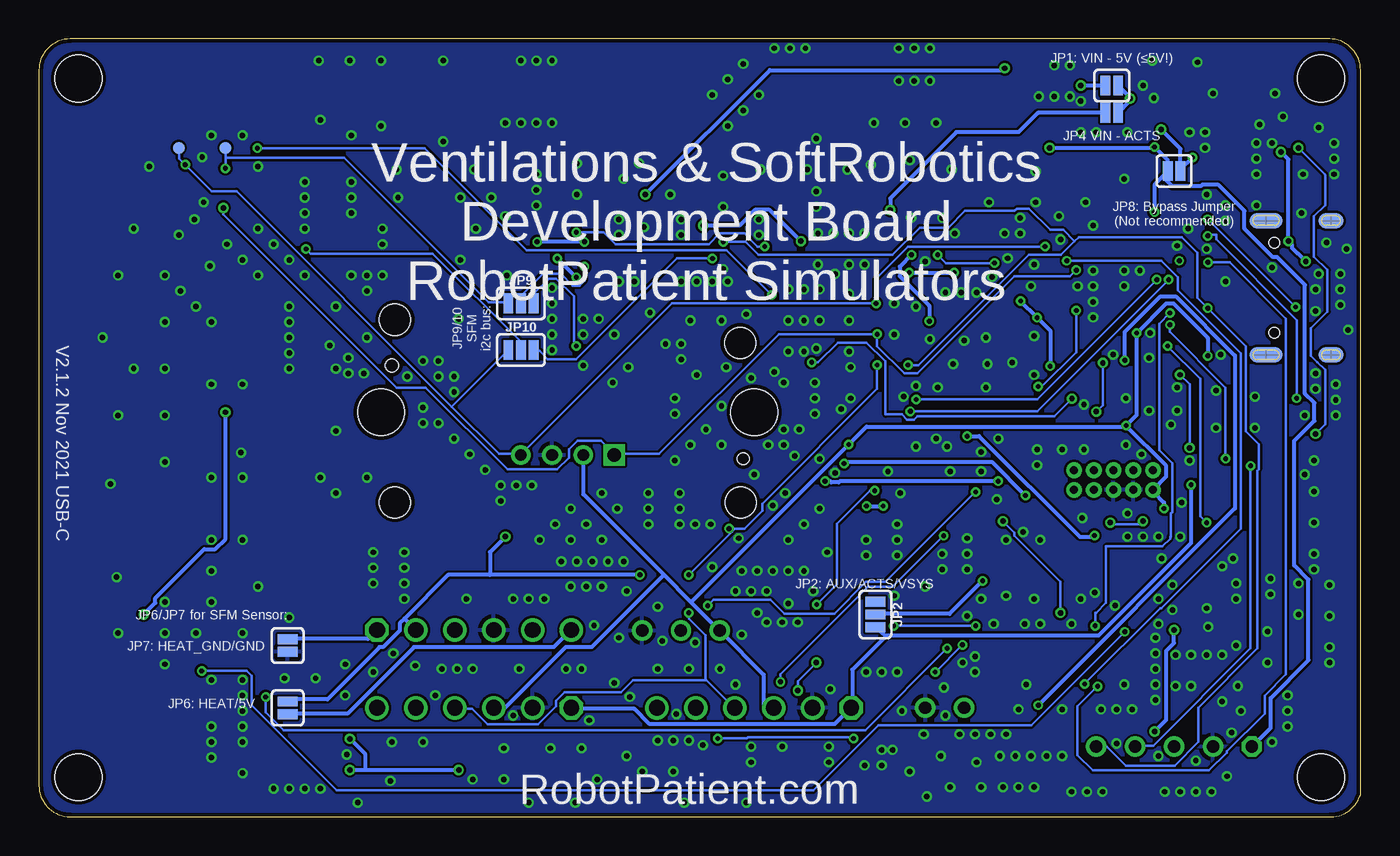
[diagram p4: board, bottom side, seen from below]

Size 85 x 50 mm. Coordinates in mm from the lower left corner, seen from the top.
Outline: 0.01,47.01 0.01,47.01
Outline: 0,1.41 0,48 arc-90 2,50 83,50 arc-90 85,48 85,2 arc-90 83,0 1.92,0 arc-67 0.07,1.24 0,1.41
Copper layers (1*16): Top 0.035mm / dielectric 1.5mm / Bottom 0.035mm
Design rules "ITEADstudio_DRC_Recent_june2014": minimum track width 6mil, minimum drill 12mil, track to track 6mil, track to pad 6mil, pad to pad 6mil, via to via 6mil, smd to smd 0mil, copper to edge 10mil, drill to drill 10mil, minimum pad ring 10mil, minimum via ring 6mil, stop-mask expansion 2mil, vias tented up to drill 100mil, thermal gap 10mil
Holes 3 mm at 2.54,2.54 2.54,47.46 82.46,47.46 82.46,2.54

### Footprints (pad centres in the part's own frame; a part is rotated, then mirrored left to right if it is on the bottom)
0805 = smd 0.8 x 1.2: 1 -0.9,0; 2 0.9,0
_0805MP = smd 1.2 x 1.3: 1 -1.016,0; 2 1.016,0
0402-CAP = smd 0.85 x 0.9: 1 -0.58,0; 2 0.58,0
0603-CAP = smd 1.1 x 1: 1 -0.85,0; 2 0.85,0
PTC-1206 = smd 1 x 1.8: 1 -1.4,0; 2 1.4,0
FIDUCIAL-1X2 = smd 1 x 1: 1 0,0
PTSM_M3_THR_UP = drill 0.8: P1 2.507,-0.04; P2 0.007,-0.04; P3 -2.493,-0.04
SO16 = smd 0.66 x 2.032: 1 -4.445,-3.073; 2 -3.175,-3.073; 3 -1.905,-3.073; 4 -0.635,-3.073; 5 0.635,-3.073; 6 1.905,-3.073; 7 3.175,-3.073; 8 4.445,-3.073; 9 4.445,3.073; 10 3.175,3.073; 11 1.905,3.073; 12 0.635,3.073; 13 -0.635,3.073; 14 -1.905,3.073; 15 -3.175,3.073; 16 -4.445,3.073
USB-C-16P = smd 0.3 x 1.45: A5 -1.25,0; A6 -0.25,0; A7 0.25,0; A8 1.25,0; B5 1.75,0; B6 0.75,0; B7 -0.75,0; B8 -1.75,0 | smd 0.6 x 1.45: GND -3.225,0; GND2 3.225,0 | smd 1 x 2.1: SHLD1 -4.32,-0.915; SHLD2 4.32,-0.915 | smd 1 x 2.1 bottom: SHLD3 -4.32,-0.915; SHLD4 4.32,-0.915 | smd 1 x 1.6: SHLD5 -4.32,-5.095; SHLD8 4.32,-5.095 | smd 1 x 1.6 bottom: SHLD6 -4.32,-5.095; SHLD7 4.32,-5.095 | smd 0.55 x 1.45: VBUS1 -2.45,0; VBUS2 2.45,0 | hole 0.65: -2.89,-1.445; 2.89,-1.445
SMT-JUMPER_2_NC_PASTE_SILK = smd 0.635 x 1.27: 1 -0.406,0; 2 0.406,0
SMT-JUMPER_3_1-NC_PASTE_SILK = smd 0.635 x 1.27: 1 -0.813,0; 2 0,0; 3 0.813,0
SMT-JUMPER_2_NC_PASTE_NO-SILK = smd 0.635 x 1.27: 1 -0.406,0; 2 0.406,0
SMT-JUMPER_2_NO_NO-SILK = smd 0.635 x 1.27: 1 -0.406,0; 2 0.406,0
2X5-PTH-1.27MM = drill 0.508 pad 1: 1 -2.54,-0.635; 2 -2.54,0.635; 3 -1.27,-0.635; 4 -1.27,0.635; 5 0,-0.635; 6 0,0.635; 7 1.27,-0.635; 8 1.27,0.635; 9 2.54,-0.635; 10 2.54,0.635
0603 = smd 1.1 x 1: 1 -0.85,0; 2 0.85,0
LED3535 = smd 1 x 0.85: 1 -1.75,0.875; 2 -1.75,-0.875; 3 1.75,-0.875; 4 1.75,0.875
LED-0603 = smd 0.8 x 0.8: A 0,-0.75; C 0,0.75
PTSM_M2_SMD = smd 2.2 x 5.6: NC0 -4.325,-3.55; NC2 4.325,-3.55 | smd 1.2 x 3.2: P1 -1.31,0.8; P2 1.25,0.8
SOT23 = smd 1 x 1.4: 1 -0.95,-1.1; 2 0.95,-1.1; 3 0,1.1
SOT23-3 = smd 0.8 x 0.9: 1 -0.95,-1; 2 0.95,-1; 3 0,1.1
0603-RES = smd 1.1 x 1: 1 -0.85,0; 2 0.85,0
0603-RES@1 = smd 1.1 x 1: 1 -0.85,0; 2 0.85,0
R0805 = smd 1.1 x 1.4: 1 -1,0; 2 1,0
TACTILE_SWITCH_SMD_4.6X2.8MM = smd 0.9 x 1: 1 -2.05,-0.8; 2 2.05,-0.8; 3 2.05,0.8; 4 -2.05,0.8
SDP5XX_6XX = drill 0.85 square: P1 -3,-2.75 | drill 0.75: P2 -1,-2.75; P$3 1,-2.75; P$4 3,-2.75 | hole 3: -12,0; 12,0 | hole 2: -11.1,4.45; 11.1,5.95; 11.1,-5.8; -11.125,-5.8 | hole 0.75: -11.3,-3 | hole 0.85: 11.3,3
PAD.03X.03 = smd 0.762 x 0.762: P$1 0,0
TQFP-48 = smd 1.5 x 0.28: 1 -4.25,2.75; 2 -4.25,2.25; 3 -4.25,1.75; 4 -4.25,1.25; 5 -4.25,0.75; 6 -4.25,0.25; 7 -4.25,-0.25; 8 -4.25,-0.75; 9 -4.25,-1.25; 10 -4.25,-1.75; 11 -4.25,-2.25; 12 -4.25,-2.75; 25 4.25,-2.75; 26 4.25,-2.25; 27 4.25,-1.75; 28 4.25,-1.25; 29 4.25,-0.75; 30 4.25,-0.25; 31 4.25,0.25; 32 4.25,0.75; 33 4.25,1.25; 34 4.25,1.75; 35 4.25,2.25; 36 4.25,2.75 | smd 0.28 x 1.5: 13 -2.75,-4.25; 14 -2.25,-4.25; 15 -1.75,-4.25; 16 -1.25,-4.25; 17 -0.75,-4.25; 18 -0.25,-4.25; 19 0.25,-4.25; 20 0.75,-4.25; 21 1.25,-4.25; 22 1.75,-4.25; 23 2.25,-4.25; 24 2.75,-4.25; 37 2.75,4.25; 38 2.25,4.25; 39 1.75,4.25; 40 1.25,4.25; 41 0.75,4.25; 42 0.25,4.25; 43 -0.25,4.25; 44 -0.75,4.25; 45 -1.25,4.25; 46 -1.75,4.25; 47 -2.25,4.25; 48 -2.75,4.25
SOT23-5 = smd 0.55 x 1.2: 1 -0.95,-1.3; 2 0,-1.3; 3 0.95,-1.3; 4 0.95,1.3; 5 -0.95,1.3
SOIC8_208MIL = smd 0.6 x 2.2: 1 -1.905,-3.315; 2 -0.635,-3.315; 3 0.635,-3.315; 4 1.905,-3.315; 5 1.905,3.315; 6 0.635,3.315; 7 -0.635,3.315; 8 -1.905,3.315
DLC-L01G-U2 = smd 0.991 x 1.524: 1 -2.54,5.08; 2 0,5.08; 3 2.54,5.08; 4 2.54,-5.08; 5 0,-5.08; 6 -2.54,-5.08
PTSM_M6_THRHOLE = drill 1 octagon: P1 6.25,1 | drill 1: P2 3.75,1; P3 1.25,1; P4 -1.25,1; P5 -3.75,1; P6 -6.25,1
PTSM_M2_THRHOLE = drill 0.8: 1 1,1; 2 3.5,1
PTSM_M5_THR_UP = drill 0.8 octagon: P1 11,2.5 | drill 0.8: P2 8.5,2.5; P3 6,2.5; P4 3.5,2.5; P5 1,2.5
PTSM_M6_TH_UP_NEUTRAL = drill 1 octagon: P1 6.25,0 | drill 1: P2 3.75,0; P3 1.25,0; P4 -1.25,0; P5 -3.75,0; P6 -6.25,0
CRYSTAL-SMD-3.2X1.5MM = smd 1 x 1.8: P$1 -1.25,0; P$2 1.25,0

### Placement (x,y rotation side)
C1  15,44 0 top
C2  79,8 270 top
C3  65,37 0 top
C4  11,16.7 180 top
C6  20.52,6.05 180 top
C8  17,25.16 0 top
C9  26.2,32.2 270 top
C11  8.65,28.76 180 top
C12  22.68,26.53 0 top
C13  22.7,31.6 180 top
C14  29,37 0 top
C15  41,37 0 top
C16  53,37 0 top
F2  7.07,41.47 0 top
FD1  3,7 0 top
FD2  78,48 0 top
HALLSENSOR  43.7,12 0 top
IC1  19,13 0 top
J2  7,34 270 top
JP1  16,47 180 bottom
JP2  31.2,13 270 bottom
JP3  67,5 270 top
JP4  16,45.25 0 bottom
JP5  15.89,21.64 0 top
JP6  69,7 90 bottom
JP7  69,11 270 bottom
JP8  12,41.5 180 bottom
JP9  54,33 0 bottom
JP10  54,30 0 bottom
L1  19.93,25.49 90 top
LED1  80,35 0 top
LED2  80,15 0 top
LED4_3.3V  5.4,20 90 top
LED4_3.3V1  5.4,18 90 top
LED4_3.3V2  5.4,24 90 top
LED4_3.3V3  5.4,22 90 top
POWER_5.0V1  61,40 0 top
POWER_5.0V2  25,40 0 top
POWER_5.0V3  37,40 0 top
POWER_5.0V4  49,40 0 top
POWER_5.0V5  5.4,26 90 top
PUMP  65,42 180 top
Q1  28,15 0 top
Q2  11.33,41.5 90 top
Q3  33,15 0 top
R1  9,22 180 top
R2  9,20 180 top
R3  1.9,41 270 top
R4  15.15,38.61 180 top
R5  31,28 0 top
R6  5,28.39 180 top
R7  14.2,41.4 90 top
R8  21.97,23.5 90 top
R9  31,30 0 top
R10  4,41 270 top
R13  61,37 90 top
R14  25,37 90 top
R15  37,37 90 top
R16  49,37 90 top
R17  9,26 180 top
R18  31,32 0 top
R19  31,34 0 top
R20  31,24 0 top
R21  31,26 0 top
R22  33,19 90 top
R23  28,19 270 top
R24  28,12 0 top
R26  33,12 180 top
R27  9,24 180 top
R28  9,18 180 top
S1  10,46.5 0 top
SDP5XX6XX1  51,26 0 top
TP1  73,43 0 bottom
TP2  76,43 0 bottom
U1  15.31,32.34 180 top
U2  9.86,13.49 180 top
U3  17.7,41.4 270 top
U4  73,5 90 top
U$1  73,35 0 top
U$2  57,8 180 top
U$3  29,8 180 top
U$4  73,15 0 top
U$5  39,8 180 top
U$6  18,7 180 top
U$9  57,12 0 top
VALVE_A  29,42 180 top
VALVE_B  41,42 180 top
VALVE_C  53,42 180 top
Y1  22.7,29.13 270 top

### Tracks (layer width: path | path; a pad name or v marks a point on that pad's centre or on a via)
3.3V  (via drill 0.3, 0.35)
  Top 0.254: LED1.2 78.18,34.06 77.19,34.06 73.08,29.95 U$1.5 v73,26 | 78.26,10.97 78.26,9.75 78.94,9.07 C2.1 | 78.26,10.97 v78.26,13 v78.25,13.01 LED2.2 | 78.26,10.97 74.91,10.97 73.91,9.98 73.08,9.98 U$4.5 72.92,9.83 72.92,4.89 71.16,3.12 69.8,3.12 U4.8 69.59,3 v65,3 | 11.43,12.8 11.43,15.47 11.51,15.54 11.51,16.61 C4.1 11.73,17.07 12.27,17.6 12.27,19.58 | 11.43,12.8 U2.5 | R2.1 9.91,19.96 10.52,19.96 10.59,19.89 10.97,19.89 11.28,19.58 12.27,19.58 | 10.47,28.98 11.05,29.57 U1.36 | 10.47,28.98 10.29,28.8 9.3,28.8 C11.1 | R8.2 21.95,24.38 21.72,24.61 19.96,24.61 L1.1 19.89,24.54 19.89,21.34 18.75,20.19 14.17,20.19 13.41,20.95 JP5.1 13.34,21.03 12.5,21.87 12.5,23.46 12.26,23.69 | R17.1 9.96,26 12.26,23.69 | v15.09,25.15 16.08,25.15 C8.1 | 12.26,23.69 14.86,26.29 15.39,26.29 16,26.9 16,28.04 U1.44 | v14.4,31.09 16,32.69 16,36.58 U1.17 | v9.83,29.62 10.47,28.98 | R19.2 31.85,33.98 31.85,32.08 R18.2 31.85,31.93 31.85,30.1 R9.2 31.85,29.95 31.85,28.04 R5.2 31.85,27.89 31.85,26.06 R21.2 31.85,25.98 R20.2 31.93,23.93 v32.92,23.93 | Q1.1 27.05,13.87 27.05,12.04 R24.1 27.13,11.96 27.36,11.96 28.35,10.97 30.94,10.97 31.93,11.96 R26.2 | R26.2 32,12.04 32,13.87 Q3.1 | R26.2 32.08,11.96 32.38,11.96 33.38,10.97 40.23,10.97 41.15,11.89 HALLSENSOR.P3 | U$6.P3 12.98,5.48 v13.25,5.48 | v12,12 11.43,12.57 11.43,12.8 | 12.27,19.58 12.42,19.58 v12.65,19.81 | U$2.P3 57,5.75 57,4 v58,3 | v65,5 65.41,5.41 JP3.1
  Bottom 0.254: v15.09,25.15 12.5,22.55 12.5,21.87 13.34,21.03 JP5.1 13.34,20.88 12.65,20.19 v12.65,19.81 | v15.09,25.15 14.4,25.83 v14.4,31.09 12.5,32.99 12.04,32.99 9.83,30.79 v9.83,29.62 | 43.05,13.79 41.22,11.96 HALLSENSOR.P3 41.15,11.89 38.4,9.13 38.4,7.15 U$5.P3 | 43.05,13.79 44.81,15.54 | 44.81,15.54 49.99,20.73 49.99,23.24 SDP5XX6XX1.P2 | 43.05,13.79 v32.92,23.93 31.77,25.07 15.16,25.07 v15.09,25.15 | 44.81,15.54 49.45,10.9 51.12,10.9 55.01,7.01 55.7,7.01 U$2.P3 | v12,12 12,11.16 12.51,10.65 12.51,6.22 v13.25,5.48 | v58,3 64,3 | 64,3 v65,3 | 64,3 64,4 v65,5 | v78.26,13 77.51,13.75 77.51,14.05 74.36,17.19 73.65,17.19 73,17.84 v73,26
5V  (via drill 0.3, 0.35)
  Top 0.254: v22.89,48.11 21.79,47.02 18.02,47.02 v18,47 | v46,40 v46.01,40.01 49.45,40.01 51.05,38.41 51.05,22 55,18.05 v55,18 | v46.34,15.54 44.75,15.54 43.61,16.69 36.35,16.69 33.07,19.96 R22.2 32.92,19.96 v31.77,19.96 | v30.71,19.96 28.04,19.96 R23.1
  Bottom 0.254: v46,40 38,48 23,48 v22.89,48.11 | JP1.2 v18,47 | 61.49,12.72 58.67,15.54 56,15.54 | 61.49,12.72 61.8,12.42 61.8,11.96 62.87,10.9 63.09,10.9 66.45,7.54 68.89,7.54 JP6.2 | v46.34,15.54 56,15.54 | v31.77,19.96 v30.71,19.96 | 61.49,12.72 60.81,12.04 U$9.P2 | v55,18 56,17 56,15.54
!RESET  (via drill 0.35)
  Top 0.152: S1.3 12.04,47.32 8,47.32 S1.4 5.56,44.91 5.56,44.77 4,43.21 v4,43 | 19.32,25.41 18.95,25.05 18.95,24.14 18.64,23.83 18.64,23.37 18.67,23.34 18.67,22.55 18.44,22.33 JP5.10 | 19.32,25.41 19.36,25.45 22.25,25.45 22.71,24.99 22.71,23.7 22.02,23.01 22.02,22.71 R8.1 21.95,22.63 19.16,19.84 18.97,19.84 18.91,19.79 16.99,19.79 v16.1,18.9 | 19.32,25.41 19.13,25.6 19.13,28.73 17.58,30.27 15.34,30.27 14.1,29.03 14.1,28.12 U1.40 | v2.9,24.61 4.88,22.63 5.18,22.63 5.49,22.33 5.49,21.49 5.54,21.49 5.66,21.37 6.64,21.37 6.76,21.49 7.29,21.49 7.5,21.27 9.73,21.27 10.2,20.8 12.5,20.8 14,19.3 v14,19
  Bottom 0.152: v14,19 14.2,18.8 16,18.8 v16.1,18.9 | v4,43 2.3,41.3 2.29,41.22 2.29,39.32 3,38.6 3,36 2.14,35.14 2.14,32.47 3.2,31.41 3.2,29.64 2.78,29.22 2.29,28.73 2.29,25.22 v2.9,24.61
A1  (via drill 0.3)
  Top 0.152: v41.99,13.56 43.66,11.89 HALLSENSOR.P2 | U1.7 19.58,32.61 23.47,32.61 24.77,31.32 24.77,24.15 24.99,23.92 24.99,21.11 v24.77,20.88
  Bottom 0.152: v24.77,20.88 30.56,15.09 31.82,15.09 33.85,13.06 37.06,13.06 37.94,13.94 41.61,13.94 v41.99,13.56
CC1
  Top 0.152: R10.2 4.04,40.08 6.71,40.08 8,38.79 8,35.51 7.77,35.28 7.01,35.28 J2.A5
CC2
  Top 0.152: 1.91,39.7 1.91,40.08 R3.2 1.91,39.7 | J2.B5 6.93,32.31 6.17,32.31 4.57,33.91 4.57,35.51 4.04,36.04 4.04,37.57 1.91,39.7
D3_SCL_PA09  (via drill 0.3, 0.35)
  Top 0.152: v73,41.68 U$1.2 73.13,39.95 v73.13,39.13 | v31.09,31.01 30.18,31.93 R18.1 | v18.29,35.13 17.6,35.81 17.6,36.58 U1.14
  Bottom 0.152: v73,41.68 73,42.37 | 73,42.37 73,42.98 TP1.P$1 | v18.29,35.13 18.69,34.73 22.27,34.73 28.5,28.5 29.34,28.5 31.09,30.25 v31.09,31.01 37.41,31.01 45.11,23.32 47.93,23.32 SDP5XX6XX1.P1 48.01,23.32 48.84,24.16 50.37,24.16 50.9,23.62 50.9,23.09 51.66,22.33 54.86,22.33 60.13,27.59 62,27.59 73.13,38.72 v73.13,39.13 | 73,42.37 65.38,42.37 56.08,33.07 54.86,33.07 JP9.1
D4_SDA_PA08  (via drill 0.3)
  Top 0.152: v75.59,41.91 75.59,40.08 U$1.3 | v31.17,32.99 30.18,33.98 R19.1 | U1.13 18.2,36.45 20.1,36.45 v20.3,36.65
  Bottom 0.152: TP2.P$1 75.97,42.98 75.97,42.29 v75.59,41.91 73.89,40.21 72.29,40.21 58.45,26.36 | v20.3,36.65 29.11,36.65 31.17,34.59 v31.17,32.99 44.27,32.99 53.95,23.32 SDP5XX6XX1.P$4 54.03,23.32 55.4,23.32 58.45,26.36 | 58.45,26.36 54.86,29.95 JP10.1
D11_SDA_PA16  (via drill 0.3)
  Top 0.152: 70.45,7.66 69.72,6.93 U4.5 | 70.45,7.66 71.25,8.46 71.25,9.75 75.51,14.02 75.51,20.04 U$4.3 | v28.57,26.82 28.42,26.67 28.42,25.83 30.1,24.16 30.1,24 R20.1 30.02,24 29.95,24 26.21,20.27 26.21,11.2 v26.59,10.82 | v13.11,34.52 12.57,35.05 11.12,35.05 U1.25 | v70.41,7.7 70.45,7.66
  Bottom 0.152: v28.57,26.82 20.8,26.82 v13.11,34.52 | v70.41,7.7 70.41,6.71 69.27,5.56 31.85,5.56 v26.59,10.82
D12  (via drill 0.3)
  Top 0.152: v9.91,18.9 9.91,18.06 R28.1 | v12.42,30.25 12.42,31.01 12.8,31.39 12.8,32.61 11.89,33.53 11.12,33.53 U1.28
  Bottom 0.152: v9.91,18.9 10.31,19.3 10.31,28.14 v12.42,30.25
D13_SCL_PA17  (via drill 0.3)
  Top 0.152: 68.39,6.44 69.19,5.64 69.65,5.64 U4.6 | 68.39,6.44 68.35,6.48 68.35,9.45 73,14.1 73,20.04 U$4.2 | v28.96,26.06 30.1,26.06 R21.1 30.18,25.98 30.94,25.22 30.94,23.39 30.79,23.24 29.64,23.24 26.82,20.42 v26.82,18.06 | v12.34,34.52 11.12,34.52 U1.26 | v37.31,8.67 37.61,8.67 38.79,7.49 38.79,6.21 41.36,3.64 45.79,3.64 50.35,8.2 55.96,8.2 56.77,7.39 56.77,7.09 57.91,5.94 63.63,5.94 64.08,6.4 68.35,6.4 68.39,6.44
  Bottom 0.152: v28.96,26.06 20.8,26.06 v12.34,34.52 | v37.31,8.67 37.31,9.17 31.69,14.78 30.1,14.78 v26.82,18.06
D14_HB  (via drill 0.35)
  Top 0.152: U1.3 19.51,30.56 17.73,30.56 17.71,30.57 15.21,30.57 15.19,30.56 13.79,30.56 12.12,28.88 12.09,28.88 v11.62,28.41 | R27.1 10.71,24 v11,23.71
  Bottom 0.152: v11,23.71 11,27.79 v11.62,28.41
D18_NEOPIXEL  (via drill 0.3, 0.35)
  Top 0.152: U1.47 17.69,27.96 17.69,27.25 17.82,27.11 18.33,27.11 v18.57,26.87 | v70.94,42.98 75.29,42.98 78.18,40.08 78.18,35.89 LED1.1 | v37.87,33.53 37.87,30.18 36.91,29.21 v35.3,29.21
  Bottom 0.152: v18.57,26.87 19.69,25.76 28.51,25.76 28.73,25.53 29.18,25.53 29.5,25.86 30.56,25.86 30.56,29.26 31.77,30.48 33.62,30.48 34.9,29.21 v35.3,29.21 | v70.94,42.98 60.2,42.98 53.65,36.42 40.77,36.42 v37.87,33.53
EOC_A_D16  (via drill 0.3)
  Top 0.152: v18.29,32.54 18.82,33.07 19.51,33.07 U1.8 | v20.73,27.66 20.73,26.66 21.64,25.76 22.63,25.76 23.93,24.46 23.93,23.77 22.71,22.55 22.71,21.95 21.95,21.18 20.95,21.18 18.39,18.62 16.64,18.62 15.16,17.14 v15.16,11.89 | v74.52,9.37 74.98,9.37 75.51,9.91 U$4.4
  Bottom 0.152: v18.29,32.54 18.29,29.87 20.5,27.66 v20.73,27.66 | v15.16,11.89 21.18,5.87 31.01,5.87 35.2,1.69 65.85,1.69 71.32,7.16 71.32,9.07 71.63,9.37 v74.52,9.37
EOC_B_D17  (via drill 0.3)
  Top 0.152: v23.55,35.59 21.49,33.53 19.58,33.53 U1.9 | v27.2,36.12 27.2,37.34 25.68,38.86 25.68,39.7 25.3,40.08 24.54,40.08 24.31,40.31 24.31,41.22 25.6,42.52 26.52,42.52 27.05,43.05 31.55,43.05 32.08,42.52 38.48,42.52 39.01,43.05 43.59,43.05 45.26,41.38 46.94,41.38 48.08,42.52 50.06,42.52 50.6,43.05 55.55,43.05 56.08,42.52 62.48,42.52 63.17,43.2 65.15,43.2 65.46,43.51 67.13,43.51 69.57,41.07 71.09,41.07 72.24,39.93 72.24,39.24 76.12,35.36 77.5,35.36 78.03,34.82 78.87,34.82 79.02,34.67 79.02,33.07 75.89,29.95 75.59,29.95 U$1.4
  Bottom 0.152: v23.55,35.59 26.67,35.59 v27.2,36.12
GND  (via drill 0.35)
  Top 0.254: 9,30 9.38,30 9.59,30.21 10.07,30.21 10.19,30.09 U1.35 | U1.5 20.47,31.59 20.56,31.5 21.05,31.5 21.15,31.6 C13.2 | J2.GND 7.01,37.26 7.01,37.57 7.47,38.02 7.47,38.63 6.86,39.24 6.71,39.24 v6.7,39.3
  other vias: 80.4,21.4 58,32 52,31 52,30 52,32 52,34 52,33 50,32 49,32 48,31 50,31 50,29 8.2,16.6 9.9,13.4 9.9,10.4 11.9,10.4 10.9,10.4 15.2,8.5 13.2,7.5 14.7,6.9 15.7,6.9 16.7,6.9 19.2,6.9 19.2,3.9 20.2,3.9 22.2,3.9 21.2,3.9 23.2,3.9 22.8,5.3 23.8,5.3 24.8,5.3 25.8,5.3 24.8,9.3 24.8,10.3 26.8,8.3 29.8,9.3 30.8,9.3 31.8,9.3 30.8,4.3 30.8,3.3 8.9,10.4 7.9,8.4 8.9,7.4 10.9,8.4 11.9,8.4 13.2,8.5 13.2,9.5 13.2,11.5 13.2,10.5 13,14 13,18 15,18 14,18 20.8,23.6 20.8,22.6 17.8,23.6 11.8,26.1 12.2,25.2 11,22.9 3,18.9 3,20.9 3,22.9 3,15.9 3,16.9 11.8,27.6 6.8,27 3.6,25.8 1.6,25.8 1.6,26.8 1.6,27.8 5.7,35.3 8.7,38.3 8.7,39.3 6.7,43.3 2.7,44.3 1.7,43.3 1.7,42.3 1.7,41.3 19.7,46.3 19.7,48.3 18.7,48.3 18.7,46.3 20.7,46.3 27.7,47.3 28.7,47.3 29.7,47.3 27.7,49.4 28.7,49.4 29.7,49.4 35.7,49.4 36.7,49.4 37.7,49.4 39.7,48.4 38.7,46.4 39.7,45.4 40.7,47.4 41.7,46.4 40.7,44.4 38.7,38.4 38.7,37.4 40.7,34.4 41.7,34.4 42.7,34.4 43.7,34.4 43.7,38.4 43.7,37.4 47.7,38.4 47.7,37.4 47.7,34.4 46.7,34.4 44.7,30.4 45.7,32.4 43.7,30.4 43.7,29.4 42.7,28.4 42.1,24.9 44.1,26.9 44.1,25.9 43.1,23.9 41.1,23.9 38.1,23.9 37.1,23.9 37.1,24.9 36.1,24.9 35.1,27.9 35.1,26.9 32.8,26.9 32.8,28.9 34.8,31.9 35.8,31.9 36.8,31.9 36.8,29.9 35.8,29.9 35,30.1 34.8,33.9 35.8,33.9 36.8,33.9 33.8,34.9 31.9,35.5 32.9,35.5 34.9,35.5 34.9,37.5 33.9,37.5 32.9,37.5 31.9,37.5 28.9,38.5 26.9,38.5 22.9,37.5 23.9,39.5 20.9,39.5 20.9,41.5 15.2,41 15,44 17,44 18,44 18,46 14,47 11,44 10,43 10,44 5,45 4,15 4,13 8,15 8,14 8,11 7.7,6.8 8.3,5.4 5.7,4.8 4.7,5.8 4.7,6.8 4.7,7.8 10.6,3.6 10.6,1.6 12.6,1.6 11.6,1.6 9.6,1.6 8.6,2.6 16.6,1.6 17.6,1.6 18.6,1.6 13,3.9 21,1.9 22,1.9 23,1.9 29,2.9 27,3.9 28.1,5.3 30.1,4.3 34.1,8.2 37.2,4.5 39.2,3.5 39.2,4.5 34.2,3.5 34.2,4.5 40.2,8.5 41.2,9.5 43.2,9.5 44,6.6 45.2,9.5 38.8,13.1 38.2,12.5 37.2,12.5 36.2,12.5 35.2,14.5 36.8,13.7 38.2,14.5 39.2,14.5 39.8,15.8 38.8,15.8 37.8,15.8 36.8,15.8 35.8,15.8 31.8,16.8 29.8,16.8 28,14.8 25.3,15.9 25.3,12.9 25.3,16.9 25.3,17.9 29.8,17.8 29.8,18.8 29.6,20.8 28.6,23.8 26.6,23.8 23.3,24.3 24.4,23.45 32.9,31.9 32.9,29.9 32.9,33.6 30,33 30,31 27.7,30.7 26.2,29.1 27.2,27.6 25.5,30.6 24,29.1 21,28.4 26.7,33.7 24.7,33.7 25.7,33.7 23.7,34.7 21.2,34.1 17.2,34.1 17.2,32.1 15.2,34.1 15.2,35.1 17.7,39.5 19.4,38.6 19.3,37.1 13.53,31.1 13.6,29.5 9.3,27.4 9.3,25 11.52,20.2 11.6,18 9,29.7 13.6,26.1 15.1,23.9 17.8,26.5 15.1,26.9 15.92,29.7 34.8,19.8 35.8,18.8 36.8,17.8 41.8,18.8 42.8,18.8 43.8,18.8 43.8,19.8 43.8,20.8 45.8,20.8 45.8,19.8 45.8,18.8 47.8,19.8 48.8,20.8 50.8,19.8 49.8,18.8 48.8,17.8 50.8,17.8 52.8,17.8 51.8,18.8 48.8,14.8 49.8,14.8 50.8,14.8 51.4,16.4 50.4,16.4 49.4,16.4 48.4,16.4 47.4,16.4 49.3,12.3 47.7,11.5 52.5,14 57.5,14 54.5,14 53.5,14 61.5,14 61.5,15 61.5,16 61.5,17 63.5,17 63.5,16 63.5,15 57.1,9.5 59.1,9.5 58.1,9.5 54.1,9.5 51.1,9.5 50.1,9.5 59.5,7.8 65.3,7.8 65.3,9.8 71.9,7.8 71.9,6.8 71.9,2.8 69.9,1.8 66.9,1.8 67.9,1.8 68.9,1.8 73.9,3.8 73.9,4.8 73.9,5.8 74.9,11.8 76.9,11.8 79.9,11.8 76.9,13.8 73.9,13.8 71.9,11.8 70.9,14.8 68.9,12.8 73.9,17.8 76.9,22.8 73.9,27.8 71.9,27.8 76.9,34.8 79.9,34.8 76.9,31.8 80.9,30.8 70.9,37.8 67.9,34.8 65.9,32.8 63.9,30.8 65.9,28.8 68.9,28.8 68.9,29.8 68.9,30.8 68.9,31.8 68.9,32.8 67.9,38.8 67.9,39.8 67.9,40.8 64.9,38.8 64.9,39.8 64.9,40.8 64.9,43.8 64.9,34.8 62.9,34.8 62.9,36.8 62.9,37.8 61.9,39.8 57.9,39.8 57.9,35.8 38.6,41.6 35.6,41.6 41,41.2 41,39.2 41,35.2 35,39.2 35,40.2 9.9,36.5 9.9,40 13.3,46.2 13.4,48.6 39,22 34.3,17 31.8,17.8 49.6,6.2 45.2,4.9 42.3,4.6 43.2,4.9 44.2,4.9 44.2,2.9 46.2,2.9 47.2,3.9 48,8.6 47,7.7 21,30.9 22.4,29.2 24.1,30.8 61.3,28.3 60.3,29.3 59.3,29.3 59.3,28.3 58.3,28.3 58.3,27.3 60.3,26.3 59.3,25.3 60.3,25.3 66.3,30.3 63.9,33.8 63.9,34.8 67.9,37.8 68.9,35.8 69.9,36.8 72.9,36.8 71.9,35.8 70.9,34.8 75.9,33.8 74.9,32.8 73.9,31.8 78.9,37.8 50.4,40 50.4,42 53,41.3 53,40.3 53,39.3 46.4,42 44.4,40 47.4,41 3.7,41.3 2.9,28.5 2.9,27.5 9.5,46.5 10.5,48.5 5.5,46.5 6.5,44.5 58.3,24.3 57.3,23.3 56.3,22.3 55.3,21.3 54.3,21.3 53.3,21.3 55.3,20.3 71.9,5.8 71.9,4.8 71.9,8.8 73.9,8.8 69.2,8.9 67.2,8.9 76.9,9.8 22,6.9 21.5,8.5 21.7,18.3 26.4,22.2 30.4,22.2 24.4,22.2 36.4,23.2 33.4,26.2 28.6,27.7 29.4,27 11.1,37.8 18,14 21,14 15.8,13.57 15.7,4.7 29.5,6.8 37,20.8 40,17.9 41.7,16.05 37.8,20 34.8,23 33.8,22.1 40.2,14.5 45.2,13.5 47.2,14.5 70.9,41.8 73.9,43.8 74.4,39.5 74.5,42.4 62.3,4.8 60.3,4.8 62.4,2.3 65.2,4 39.5,0.9 43.5,0.9 50.5,0.9 53.5,0.9 64.5,0.9 54.5,6.5 26.1,37.5 28,35.7 28.6,32.8 26.3,41.6 27.3,44.6 31.3,44.6 29.3,44.6 29,42.2 31.5,41.9 35,43.6 33,41.6 52,44.6 55,44.6 54,44.6 53,44.6 57,41.6 62,41.6 55,38.6 59,43.4 63,44.4 75,38.4 76,37.4 74,35.4 72,23.4 80,15.4 37.7,28.6 39.2,28.2 40.8,28.9 39.5,32.3 64.1,28.5 65.1,28.5 65.1,29.5 30,14.2 21,35.5 22.7,35.9 21.9,37.5 21.9,38.5 17.2,38 14.2,35.1 18.2,34.1 17.2,35.1 17.2,33.1 24.1,27.6 27.3,24.3 19.2,23.6 14.1,23.3 22.8,17.8 23.4,20.4 22.8,14.2 24.4,14 26.9,16.9 26.9,15.9 6.7,42.3 6.7,41.3 5.7,43.3 35.1,25.9 37.1,27.9 41.1,31.9 43.1,31.9 46.1,37.9 47.1,28.9 48.1,27.9 44.1,22.9 41.1,26.4 52.1,4.4 55.1,4.4 50.1,4.4 55.1,2.4 57.1,2.4 49.1,2.4 62.2,10.5 63.5,9.3 60.8,9.7 73.9,15.8 71.9,17.8 71.9,21.8 73.9,21.8 76.9,25.8 79.9,25.8 76.9,28.8 78.9,28.8 77.9,41.8 71.9,43.8 66.9,44.8 52,48.6 53,48.6 54,48.6 59,48.6 63,48.6 65,48.6 67,48.6 56.9,37.8 54.9,34.8 55.9,39.8 0.9,36.5 0.8,31.3 6.8,25 3.6,22 12.8,16.6 8.9,16.1 12.1,14.9 12.1,13.3 9.8,12.2 13,12.4 17.1,14.4 20.6,17.8 18.6,12.4 20.6,12.4 21.6,12.4 23.6,12.4 25.6,9.9 26.7,6.5 24.7,3.5 26.4,1.9 24.4,1.9 27.9,1.3 31.9,3.3 15,19.5 17.9,19.2 2.2,36.9 3.8,38.8 1.3,34.9 1.3,32.9 1.3,33.9 2.9,33.9 2.7,34.9 2.9,32.5 8.7,34.4 11.8,36.7 5.8,15.3 5.8,14.3 2,14.9 2,12.9 2,9.9 2,10.9 6,9.9 6,11.9 39.8,11.7 42.8,11.2 44.9,11.3 65.9,24.8 65.9,20.8 63.9,21.8 66.9,21.8
  pour Bottom: -2.63,51.67 87.5,51.88 87.5,-2.53 -2.63,-2.53
  pour Top: 96.5,61.68 96.5,-4.53 -3.63,-4.53 -3.63,61.68
HEAT
  Bottom 0.254: JP6.1 68.96,6.63 65.15,6.63 60.88,10.9 51.89,10.9 50.83,11.96 U$9.P6
HEAT_GND
  Bottom 0.254: JP7.1 68.96,11.43 63.86,11.43 63.32,11.96 U$9.P1
ID  (via drill 0.3)
  Top 0.152: U3.1 16.46,42.29 16.46,41.45 U3.2 16.54,41.45 18.21,41.45 18.67,41 19.66,41 19.89,40.77 19.89,40.08 18.44,38.63 16,38.63 R4.1 15.93,38.56 15.24,37.87 13.49,37.87 12.95,38.41 v9.83,38.41 | v4.19,32.77 4.19,28.5 R6.2
  Bottom 0.152: v9.83,38.41 v4.19,32.77
INT
  Top 0.152: U$2.P6 61.34,8.91 49.45,8.91 47.55,7.01 45.26,7.01 U$5.P6
N$1
  Top 0.152: LED4_3.3V2.A 6.17,24 8.08,24 R27.2
N$2
  Top 0.152: LED4_3.3V1.A 6.17,17.98 8.08,17.98 R28.2
N$3
  Top 0.152: LED4_3.3V3.A 6.17,22.02 8.08,22.02 R1.2
N$8
  Top 0.152: C12.2 23.24,26.59 23.24,27.28 22.71,27.81 Y1.P$2 22.63,27.89 20.95,29.57 19.58,29.57 U1.1
N$12
  Top 0.152: Q2.1 12.34,40.54 14.17,40.54 R7.1 14.25,40.54 14.86,39.93 17.14,39.93 17.6,40.39 18.97,40.39 U3.4
N$13
  Top 0.152: C13.1 23.24,31.55 23.24,30.94 22.71,30.4 Y1.P$1 22.63,30.33 22.4,30.1 19.58,30.1 U1.2
N$24
  Top 0.152: POWER_5.0V1.A 61.04,39.24 61.04,37.87 R13.2
N$25
  Top 0.152: POWER_5.0V2.A 24.99,37.87 R14.2
N$27
  Top 0.152: POWER_5.0V3.A 37.03,39.24 37.03,37.87 R15.2
N$28
  Top 0.152: POWER_5.0V4.A 49,37.87 R16.2
N$29
  Top 0.152: POWER_5.0V5.A 6.17,25.98 8.08,25.98 R17.2
N$33
  Top 0.152: LED4_3.3V.A 6.17,20.04 8.08,20.04 R2.2
NEOPIXEL_2
  Top 0.152: LED1.3 78.26,30.63 78.26,15.93 LED2.1
PROG_LED_D2  (via drill 0.3)
  Top 0.152: v4.12,26.9 4.65,26.36 4.65,26.06 POWER_5.0V5.C | 13.03,37.34 13.03,36.65 U1.23 13.03,37.34 | v9.83,37.34 10.06,37.11 11.36,37.11 11.62,37.38 12.04,37.8 12.57,37.8 13.03,37.34
  Bottom 0.152: v9.83,37.34 9.83,37.41 9.3,37.41 9.3,37.11 4.12,31.93 v4.12,26.9
PUMP_D6  (via drill 0.35)
  Top 0.152: IC1.1 14.63,9.98 14.63,10.59 16.84,12.8 18,12.8 18.3,13.1 v19.3,13.1 | v23,19 24.34,20.34 24.99,20.34 25.82,21.18 25.83,21.18 25.83,27.2 28.27,29.64 28.27,32.34 28.04,32.57 28.04,34.52 25.6,36.96 24.46,36.96 19.81,41.6 18.52,41.6 17.22,42.9 15.75,42.9 15.57,42.72 15.57,42.16 14.74,41.33 13.61,41.33 13.46,41.18 11.79,41.18 11.65,41.05 11.65,40.84 10.68,40.84 10.39,40.56 9.67,40.56 9.6,40.54 9.3,40.23 9.3,38.1 8.99,37.79 8.99,35.21 8.99,35.2 9.22,35.2 10.06,34.37 10.06,33.38 10.29,33.15 10.97,33.15 U1.29
  Bottom 0.152: v23,19 22.26,18.26 22.26,18.07 19.3,15.11 v19.3,13.1
PUMP_GND
  Top 0.254: POWER_5.0V1.C 61.04,40.77 63.32,40.77 63.7,41.15 PUMP.P2 | C3.1 64.08,37.03 64.08,40.01 63.4,40.69 PUMP.P2 | IC1.16 14.55,16 14.55,11.73 13.95,11.12 13.95,8.76 14.94,7.77 24.92,7.77 27.66,10.52 60.73,10.52 62.18,11.96 62.18,18.29 67.21,23.32 67.21,42.9 66.98,43.13 65.61,43.13 63.78,41.3 PUMP.P2
SCL_PA23  (via drill 0.3)
  Top 0.152: v12.27,31.62 11.12,31.62 U1.32 | v8.69,23.01 7.54,23.01 v7.09,22.55 | v31.09,29.03 30.18,29.95 R9.1 | v43.2,13.11 v43.2,15.54 | v50.44,30.25 48.69,28.5 48.69,26.59 v40.62,18.52 | U$6.P4 14.55,4.5 15.09,4.5 16,3.58 18.06,3.58 19.2,4.72 29.03,4.72 33.11,8.8 36.1,8.8 36.6,9.3 37.94,9.3 40.23,7.01 U$5.P4
  Bottom 0.152: v12.27,31.62 12.27,31.17 8.69,27.58 v8.69,23.01 | v7.09,22.55 7.09,10.82 13.34,4.57 14.48,4.57 U$6.P4 | v31.09,29.03 31.09,27.51 38.48,20.12 38.48,19.66 39.62,18.52 40.23,18.52 40.42,18.33 | v43.2,15.54 40.42,18.33 | v43.2,13.11 43.2,12.72 42.14,11.66 42.14,8.84 42.1,8.8 | 42.1,8.8 40.31,7.01 U$5.P4 | v50.44,30.25 50.6,30.4 50.6,33.45 51.74,34.59 52.2,34.59 53.11,33.68 53.11,33.07 JP9.3 | 40.42,18.33 v40.62,18.52 | U$2.P4 58.22,6.93 57.15,6.93 56.16,5.94 52.88,5.94 51.74,7.09 51.74,7.47 51.21,8 47.55,8 46.79,8.76 42.14,8.76 42.1,8.8
SCL_SFM  (via drill 0.3)
  Top 0.152: 33.98,13.64 33.98,13.87 Q3.2 33.98,13.64 | 33.98,13.64 33.98,12.04 R26.1 | v49.91,35.36 49.91,36.2 50.44,36.73 v50.44,37.57 | v38.33,36.65 38.33,36.04 36.8,34.52 34.59,34.52 33.98,33.91 33.98,24.23 31.24,21.49 v31.24,20.95 | 33.98,13.64 v34.98,13.64
  Bottom 0.152: v49.91,35.36 49.91,34.44 50.22,34.14 50.67,34.14 51.44,34.9 52.58,34.9 53.95,33.53 53.95,33.07 JP9.2 | v50.44,37.57 48.69,37.57 47.93,36.8 41.91,36.8 41.22,37.49 39.62,37.49 38.79,36.65 v38.33,36.65 | v31.24,20.95 31.55,20.95 33.68,18.82 33.68,14.94 v34.98,13.64
SCL_SFM_5V
  Top 0.152: Q3.3 32.99,16.15 32.99,17.98 R22.1 32.92,17.98 31.24,19.66 31.24,20.19 31.85,20.8 35.14,20.8 38.87,17.07 53.19,17.07 58.22,12.04 U$9.P3
SDA_PA22  (via drill 0.3)
  Top 0.152: U$2.P5 60.73,7.01 60.73,7.39 59.59,8.53 50.22,8.53 47.62,5.94 43.81,5.94 42.82,6.93 U$5.P5 42.73,6.42 v41.34,5.03 | v29.11,29.03 30.1,28.04 R5.1 | v9.83,32.69 9.83,32.54 10.21,32.16 11.05,32.16 U1.31 | v41.68,35.89 41,36.58 v41,36.96 | v32.61,5.03 29.79,5.03 27.66,2.9 14.78,2.9 13.56,4.12 13.56,4.88 14.1,5.41 16.15,5.41 16.99,4.57 U$6.P5
  Bottom 0.152: v29.11,29.03 28.42,29.03 21.34,36.12 19.28,36.12 18.4,36.99 | 18.4,36.99 18.14,37.26 11.51,37.26 10.5,36.26 10.5,33.36 v9.83,32.69 7.39,30.25 7.39,24.77 6.55,23.93 6.55,22.33 6.63,22.25 6.63,10.82 10.44,7.01 10.44,4.8 11.96,3.28 15.09,3.28 16.31,4.5 U$6.P5 | v41.68,35.89 43.97,35.89 50.44,29.41 52.27,29.41 52.81,29.95 53.11,29.95 JP10.3 | v41,36.96 39.55,36.96 38.71,36.12 30.1,36.12 28.35,37.87 26.52,37.87 25.45,38.94 22.25,38.94 22.1,39.09 21.34,39.09 19.96,37.72 19.13,37.72 18.4,36.99 | v41.34,5.03 39.47,5.03 39.4,5.11 32.69,5.11 v32.61,5.03
SDA_SFM  (via drill 0.3, 0.35)
  Top 0.152: 28.96,12.27 28.96,13.87 Q1.2 | 28.96,12.27 28.96,12.04 R24.2 28.96,12.27 | v67.82,36.5 67.82,35.74 71.32,32.23 71.32,25.91 77.5,19.74 77.5,15.32 78.03,14.78 78.87,14.78 79.32,14.33 79.32,10.29 79.93,9.68 79.93,6.25 77.34,3.66 74.6,3.66 73.15,2.21 70.33,2.21 70.18,2.36 63.32,2.36 62.64,1.68 42.82,1.68 38.56,5.94 37.41,5.94 36.27,7.09 36.27,8.03 v36.19,8.11 | v25.6,11.05 25.6,11.43 v24.77,12.27 | 28.96,12.27 v30.02,12.27 | v27.36,9.3 28.06,10 35,10 v35,9.91
  Bottom 0.152: v67.82,36.5 67.51,36.2 59.66,36.2 54.03,30.56 54.03,30.02 JP10.2 | v25.6,11.05 v27.36,9.3 | v30.02,12.27 v24.77,12.27 | v35,9.91 36.19,8.72 v36.19,8.11
SDA_SFM_5V
  Top 0.152: R23.2 28.04,17.98 28.04,16.15 Q1.3 28.12,16.15 31.39,16.15 32.75,14.8 33.33,14.8 33.35,14.83 33.73,14.83 34.1,15.2 41.7,15.2 42.8,16.31 43.46,16.31 46.73,13.03 52.2,13.03 53.19,12.04 U$9.P5
SWCLK  (via drill 0.35)
  Top 0.152: U1.45 16.61,28.12 16.61,29.14 v16.57,29.17 | JP5.4 14.63,22.25 16.99,24.61 v16.99,26.03 v17,26.04
  Bottom 0.152: v17,26.04 16.57,26.46 v16.57,29.17
SWDIO
  Top 0.152: U1.46 16.99,28.04 16.99,27.28 15.62,25.91 15.09,25.91 13.41,24.23 13.41,22.33 JP5.2
USB_D_N
  Top 0.152: U1.33 9.82,31.09 9,31.91 9,32.9 8.15,33.75 8.05,33.75 | 8.05,33.75 J2.A7 | J2.B7 8.05,34.75 8.05,33.75
USB_D_P
  Top 0.152: U1.34 9.89,30.59 8.7,31.78 8.7,32.77 8.22,33.25 J2.B6 5.97,33.25 5.97,34.25 J2.A6
USB_HOST_EN
  Top 0.152: R6.1 5.87,28.35 6.78,28.35 8.33,26.8 14,26.8 14.55,27.36 14.55,28.04 U1.41
VALVE_A_D5  (via drill 0.3)
  Top 0.152: v16.92,8.38 15.85,9.45 15.85,9.91 IC1.2 | U1.24 12.5,36.58 v11.66,35.74 11.56,35.64 v9.82,35.64
  Bottom 0.152: v16.92,8.38 18.21,7.09 18.21,3.96 17.22,2.97 9.75,2.97 8.61,4.12 8.61,4.19 6.17,6.63 6.17,7.77 4.8,9.14 4.8,32.02 8.42,35.64 v9.82,35.64
VALVE_A_GND  (via drill 0.3)
  Top 0.254: POWER_5.0V2.C 25.07,40.77 27.36,40.77 27.74,41.15 VALVE_A.P2 27.43,40.69 28.04,40.08 28.04,37.03 C14.1 28.12,36.88 v28.88,36.12 | v17.12,18.08 15.85,16.81 15.85,16.08 IC1.15 | v25.3,24.46 25.3,29.41 v27.74,31.85
  Bottom 0.254: v17.12,18.08 17.22,17.98 18.05,17.98 24.54,24.46 v25.3,24.46 | v27.74,31.85 27.74,32.84 29.64,34.75 29.64,35.36 v28.88,36.12
VALVE_B_D7  (via drill 0.3)
  Top 0.152: v12.27,32.38 12.12,32.54 11.12,32.54 U1.30 | v17.07,12.27 17.07,9.98 IC1.3
  Bottom 0.152: v12.27,32.38 12.95,31.7 12.95,23.55 12.12,22.71 12.12,19.58 12.19,19.51 12.19,18 12.25,18 12.25,17.88 12.75,17.38 16.38,17.38 16.38,13.75 17,13.12 17.07,13.11 v17.07,12.27
VALVE_B_GND  (via drill 0.3)
  Top 0.254: POWER_5.0V3.C 37.03,40.77 39.32,40.77 39.7,41.15 VALVE_B.P2 39.4,40.69 40.08,40.01 40.08,37.03 C15.1 40.08,36.88 38.48,35.28 38.48,28.19 33.22,22.94 v33.22,22.71 | v21.55,20.64 21.17,20.64 17.14,16.61 17.14,16.08 IC1.14
  Bottom 0.254: v21.55,20.64 23.72,22.81 33.12,22.81 v33.22,22.71
VALVE_C_D9  (via drill 0.3)
  Top 0.152: v18.9,35.74 19.51,35.13 U1.12 | v17.75,8.53 17.75,9.3 18.36,9.91 IC1.4
  Bottom 0.152: v18.9,35.74 12.8,35.74 11.75,34.69 11.75,33.85 7.7,29.79 7.7,18.52 12.8,13.41 12.88,13.41 v17.75,8.53
VALVE_C_GND  (via drill 0.3)
  Top 0.254: POWER_5.0V4.C 49.07,40.77 51.36,40.77 51.74,41.15 VALVE_C.P2 51.44,40.69 52.05,40.08 52.05,37.03 C16.1 51.97,36.96 51.66,36.65 v51.66,35.89 | v23.32,21.57 18.44,16.69 18.44,16.08 IC1.13 | v34.44,21.57 37.19,21.57 39.93,24.31 40.08,24.31 v50.44,34.67
  Bottom 0.254: v51.66,35.89 v50.44,34.67 | v23.32,21.57 33.48,21.57 33.55,21.49 34.05,21.49 34.12,21.57 v34.44,21.57
VBUS  (via drill 0.35)
  Top 0.254: v4.65,37 4.65,36.45 4.92,36.18 5.85,36.18 6.11,36.45 J2.VBUS1 | v5.13,42.73 5.67,42.19 F2.1 | J2.VBUS2 6.73,31.82 6.16,31.82 3.53,34.45 v3.53,35.7
  Bottom 0.254: v5.13,42.73 4.65,42.25 v4.65,37 4.41,36.76 4.41,36.55 4.05,36.19 4.02,36.19 v3.53,35.7
VDDANA  (via drill 0.3)
  Top 0.254: v21.87,33.15 23.47,33.15 23.77,32.84 26.14,32.84 C9.1 | v20.8,32.08 19.58,32.08 U1.6 | v19.96,28.96 19.96,26.36 L1.2
  Bottom 0.254: v21.87,33.15 v20.8,32.08 19.96,31.24 v19.96,28.96
VDDCORE  (via drill 0.3)
  Top 0.254: v20.73,7.16 21.03,6.86 21.03,6.1 C6.1 | v15.16,29.34 15.54,28.96 15.54,28.12 U1.43
  Bottom 0.254: v20.73,7.16 8.08,19.81 8.08,29.64 11.89,33.45 12.88,33.45 15.16,31.17 v15.16,29.34
VIN  (via drill 0.3, 0.35)
  Top 0.254: v13.26,38.86 13.49,38.63 14.25,38.63 R4.2 | 13.26,42.44 14.02,42.44 14.17,42.29 R7.2 14.1,42.52 14.1,43.97 C1.1 | 13.26,42.44 12.34,42.44 Q2.2 | 13.26,42.44 v13.26,43.05 | U2.1 10.74,14.86 10.74,15.24 10.29,15.7 9.45,15.7 8.91,15.16 8.91,14.86 U2.3 8.84,14.71 8.84,13.41 7.01,11.58 7.01,6.09 | 7.01,6.09 7.01,4.57 U$6.P1 | 7.01,6.09 17.87,6.09 18.7,5.26 21.64,5.26 23.32,6.93 25.45,6.93 U$3.2 | U3.5 19.65,43 v20,43
  Bottom 0.254: v13.26,38.86 13.26,40.62 12.42,41.45 JP8.2 | v13.26,43.05 13.21,43 | 13.21,43 12.42,42.22 12.42,41.6 JP8.2 | U$6.P1 6.93,4.57 5.79,5.71 5.79,7.62 3.35,10.06 3.35,15.24 4.27,16.15 4.27,24.16 2.97,25.45 2.97,26.59 3.58,27.2 3.58,34.18 5.37,35.97 5.64,35.97 7.47,37.8 7.47,38.94 9.14,40.62 10.21,40.62 10.29,40.54 12.12,40.54 12.65,41.07 JP8.2 | v20,43 13.21,43
VIN_ACTS  (via drill 0.3, 0.35)
  Top 0.254: C16.2 53.95,37.03 53.95,40.84 54.25,41.15 VALVE_C.P1 | PUMP.P1 66.29,41.15 65.91,40.77 65.91,37.11 C3.2 65.84,36.96 65,36.12 61.04,36.12 R13.1 60.88,36.2 60.12,36.96 54.03,36.96 C16.2 | VALVE_B.P1 42.29,41.15 v42.29,38 42.29,37.49 41.91,37.11 C15.2 41.91,36.96 42.67,36.2 49,36.2 R16.1 49.07,36.27 49.76,36.96 v49.91,36.96 | v24.31,15.16 23.47,16 IC1.9 23.55,16.15 23.55,18.36 27.96,22.78 27.96,28.8 29.26,30.1 29.26,34.75 | 36.2,36.2 30.71,36.2 30.26,36.65 | 36.2,36.2 36.96,36.2 R15.1 | 30.26,36.65 29.95,36.96 C14.2 29.95,37.11 30.25,37.41 v30.25,39 30.25,41.15 VALVE_A.P1 | 29.26,34.75 29.26,35.65 30.26,36.65 | v26.14,34.98 25.07,36.04 R14.1 | 29.26,34.75 v29.03,34.98 | v52.96,36.96 53.8,36.96 C16.2 | 36.2,36.2 36,36.39 v36,37
  Bottom 0.254: v24.31,15.16 26.44,13.03 31.14,13.03 JP2.2 | v29.03,34.98 v26.14,34.98 | v49.91,36.96 v52.96,36.96 | v42.29,38 39.96,38 38.95,39.01 38.01,39.01 v36,37 | JP4.1 20.75,45.25 22,44 26,44 30.25,39.75 v30.25,39
VIN_FUSED  (via drill 0.3, 0.35)
  Top 0.254: F2.2 8.53,41.53 10.21,41.53 Q2.3 10.21,41.6 10.9,42.29 v10.82,42.37 | v12.83,44.17 v14.83,46.17
  Bottom 0.254: v10.82,42.37 11.58,41.6 | 11.58,41.6 JP8.1 | 11.58,41.6 11.58,42.92 v12.83,44.17 | JP1.1 14.83,46.24 v14.83,46.17 14.83,46.01 JP4.2
VSYS  (via drill 0.3)
  Top 0.254: v10.9,21.34 10.29,21.95 9.91,21.95 R1.1
  Bottom 0.254: v10.9,21.34 10.9,17.6 16.84,11.66 30.48,11.66 30.54,11.6 | 30.54,11.6 JP2.3 | 30.54,11.6 32.69,9.45 32.69,7.01 U$5.P1 32.84,6.93 33.83,5.94 45.72,5.94 46.71,6.93 50.75,6.93 U$2.P1
WP
  Top 0.152: JP3.2 67.06,4.57 69.49,4.57 69.65,4.42 U4.7

### Text on the board
_tsilk: RESET | Valve A | Valve A | Valve B | Valve C | Pump | Sense B | RobotPatient.com | HB | Sensor 0 | VSYS | 3.3V | Health | Sensor 1 | Analog | SFM3x00 | Sense A | Port A | Ext VIN / Supply | Port B | Port C | JP3: Write protection
_bsilk: JP1: VIN - 5V (≤5V!) | JP4 VIN - ACTS | JP8: Bypass Jumper / (Not recommended) | Ventilations & SoftRobotics / Development Board / RobotPatient Simulators | JP9/10 / SFM / i2c bus: | JP2: AUX/ACTS/VSYS | JP6/JP7 for SFM Sensor: | JP7: HEAT_GND/GND | JP6: HEAT/5V | RobotPatient.com